# Altium project PROC101D_SCH_With_Design_Updates..Notes_V1.0.PrjPcb (part 11 of 23)

## Sheet 25.SchDoc
size 513 x 386 mm
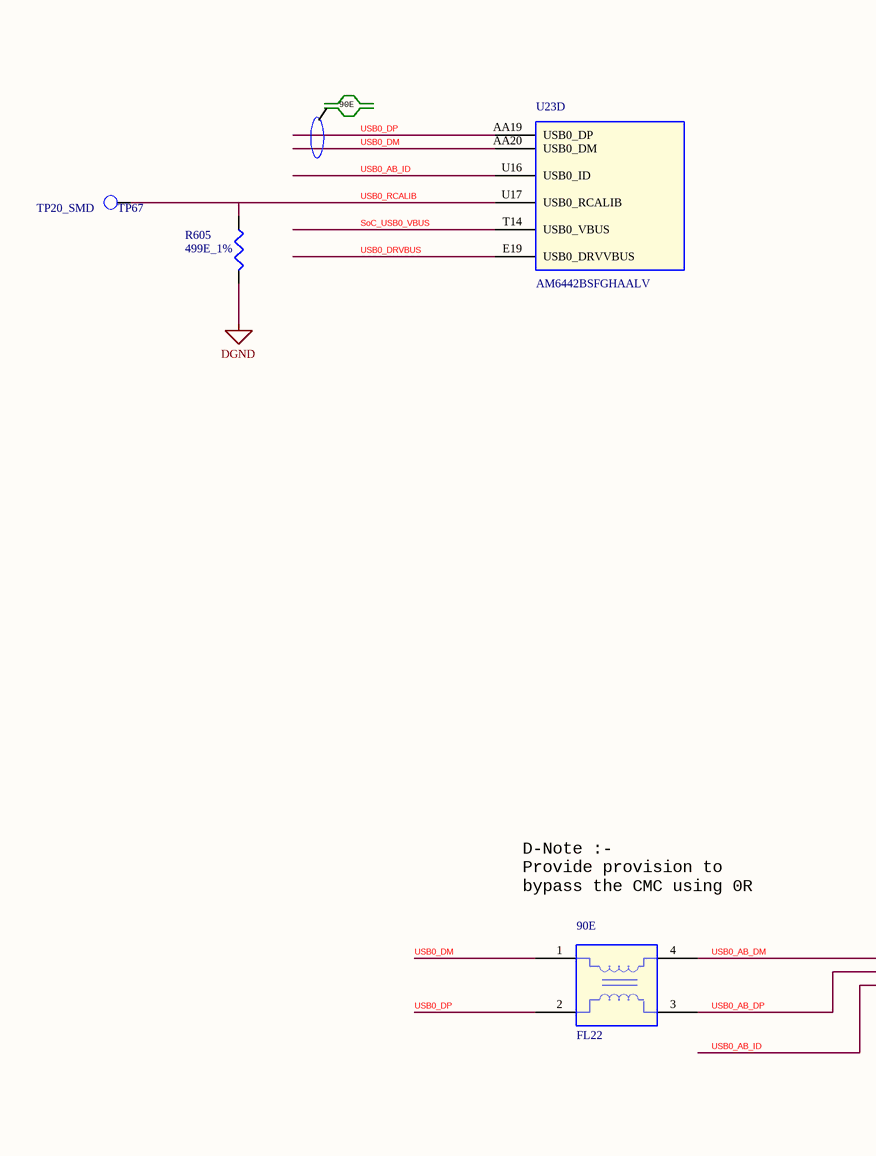
[diagram p42: 25.SchDoc, left]
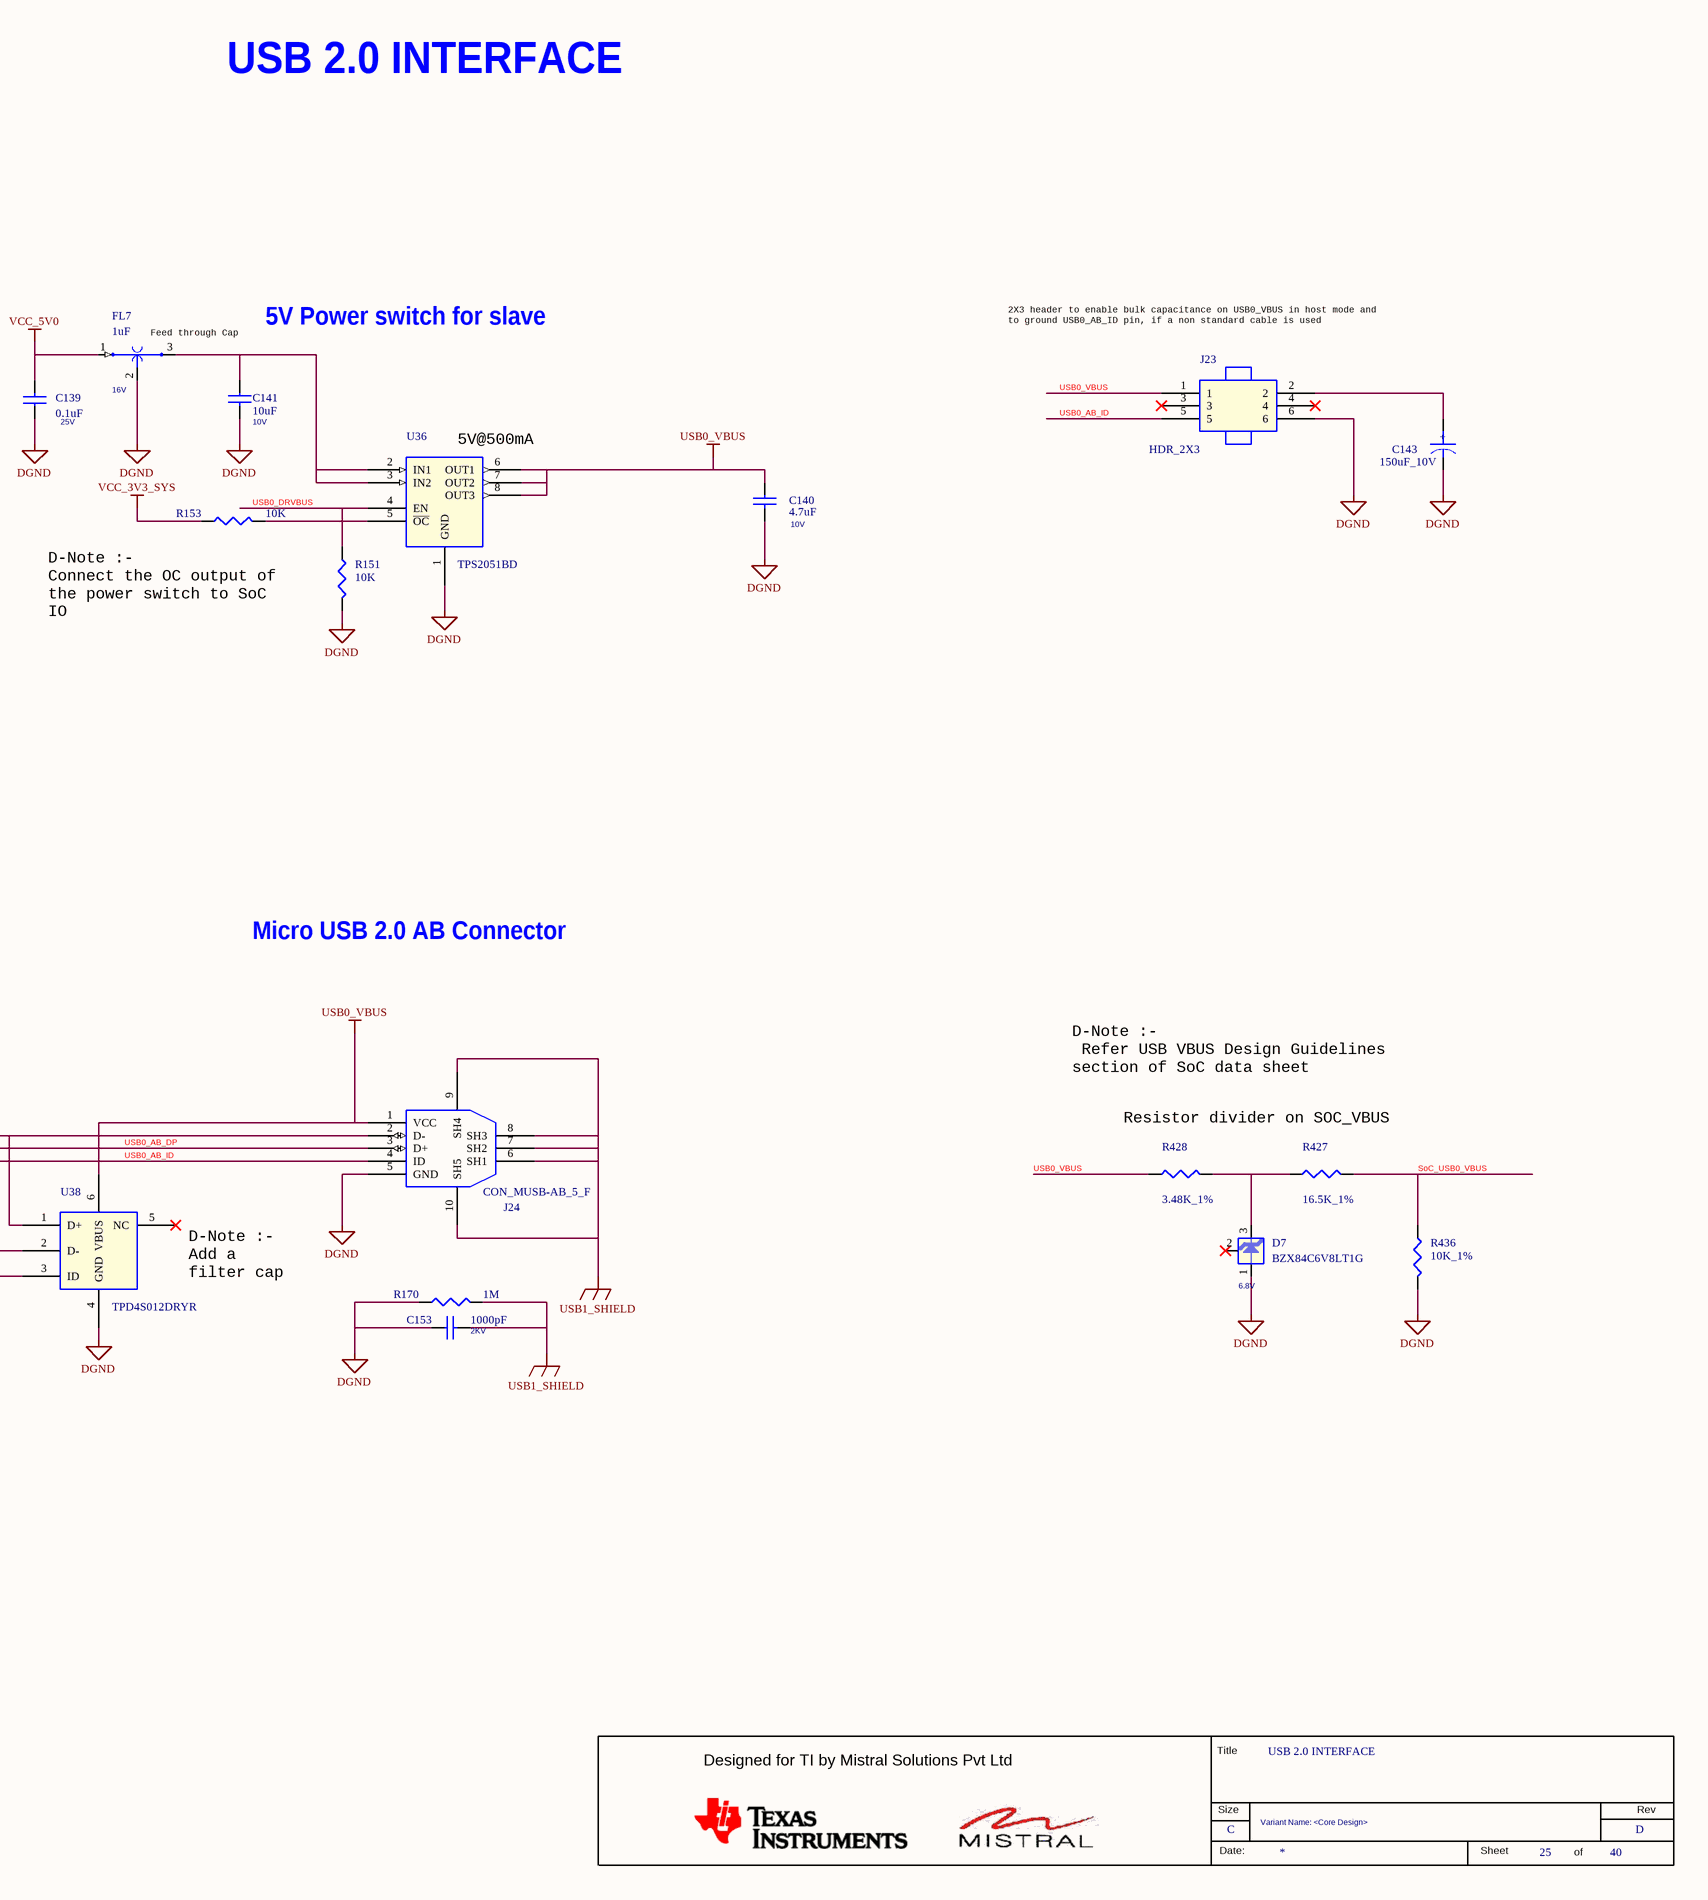
[diagram p43: 25.SchDoc, right]

### Parts
(Parts that share a designator on the sheet are numbered #1, #2 ... from top to bottom, then left to right.)
*#25  RevCode: D  Title: USB 2.0 INTERFACE  Page Size: C  Page Number: 25  Page Count: 40  Variant Name: <Core Design>  (hidden comment: MISTRAL_TITLEBLK_CSIZE)  (graphical)
C139  0.1uF  Voltage: 25V  [CAP0402_0-75]
C140  4.7uF  Voltage: 10V  [CAP0402_0-75]
C141  10uF  Voltage: 10V  [CAP0402_0-75]
C143  150uF_10V  [CAPT7343D_3-25]
C153  1000pF  Voltage: 2KV  [CAP1206_1-75]
D7  BZX84C6V8LT1G  Voltage: 6.8V  [SOT23-123_1-2]
FL7  1uF  Voltage: 16V  [FILT3_NFM21PC_0805_1]
FL22  90E  [IND4_ACM2012_90X50_SMD_1-3]
J23  HDR_2X3  [CON_3X2_SM_2MM]
J24  CON_MUSB-AB_5_F  [CON_USBAB5_ZX62RD-AB-5P8_S_R_S_3-2]
R151  10K  [RES0402_0-5]
R153  10K  [RES0402_0-5]
R170  1M  [RES0603_0-75]
R427  16.5K_1%  [RES0402_0-5]
R428  3.48K_1%  [RES0402_0-5]
R436  10K_1%  [RES0402_0-5]
R605  499E_1%  [RES0402_0-5]
TP67  TP20_SMD  [TP20_SMD]
U23  AM6442BSFGHAALV  [FCBGA441_31-49_680X680_2-6]  (part D of 16)
U36  TPS2051BD  [SOIC8_1-8]
U38  TPD4S012DRYR  [SON6_SN74LVC2G17_40X60_0-6]

### Nets
DGND: C139.1 C140.2 C141.2 C143.2 C153.1 D7.1(A) FL7.2(GND) J23.6 J24.5(GND) R151.2 R170.1 R436.2 R605.2 U36.1(GND) U38.4(GND)
USB0_VBUS: C140.1 J23.1 J24.1(VCC) R428.1 U36.6(OUT1) U36.7(OUT2) U36.8(OUT3) U38.6(VBUS)
USB1_SHIELD: C153.2 J24.6(SH1) J24.7(SH2) J24.8(SH3) J24.9(SH4) J24.10(SH5) R170.2
VCC_3V3_SYS: R153.1
VCC_5V0: C139.2 FL7.1(INPUT)
SoC_USB0_VBUS: R427.2 R436.1 U23.T14(USB0_VBUS)
USB0_AB_DM: FL22.4 J24.2(D-) U38.1(D+)
USB0_AB_DP: FL22.3 J24.3(D+) U38.2(D-)
USB0_AB_ID: J23.5 J24.4(ID) U23.U16(USB0_ID) U38.3(ID)
USB0_DM: FL22.1 U23.AA20(USB0_DM)
USB0_DP: FL22.2 U23.AA19(USB0_DP)
USB0_DRVBUS: R151.1 U23.E19(USB0_DRVVBUS) U36.4(EN)
USB0_RCALIB: R605.1 TP67.1(TP) U23.U17(USB0_RCALIB)
NetC141_1: C141.1 FL7.3(OUTPUT) U36.2(IN1) U36.3(IN2)
NetC143_1: C143.1 J23.2
NetD7_3: D7.3(C) R427.1 R428.2
NetR153_2: R153.2 U36.5(~{OC})

Not connected (* = marked no-connect by the designer): D7 2(NC)*; J23 3* 4*; U38 5(NC)*

### Notes on the sheet
- USB 2.0 INTERFACE
- 2X3 header to enable bulk capacitance on USB0_VBUS in host mode and
  to ground USB0_AB_ID pin, if a non standard cable is used
- 90E
- (near FL7) Feed through Cap
- 5V Power switch for slave
- (near U36) 5V@500mA
- (near R153) D-Note :-
  Connect the OC output of
  the power switch to SoC
  IO
- Micro USB 2.0 AB Connector
- D-Note :-
  Provide provision to
  bypass the CMC using 0R
- D-Note :-
  Refer USB VBUS Design Guidelines
  section of SoC data sheet
- Resistor divider on SOC_VBUS
- D-Note :-
  Add a
  filter cap
- (in symbol CAP_POL_Dup1) +
- (in symbol MISTRAL_TITLEBLK_CSIZE) Title; Designed for TI by Mistral Solutions Pvt Ltd; Size; Rev; Date:; Sheet; of

### Library data of the parts
*#25 = MISTRAL_TITLEBLK_CSIZE: Issue: 1.0; Page Create Date: March  8, 1995; Page Modify Date: *
C139 = CAP_Dup3: as C185 on sheet 22; PCB Footprint: CAP0402_0-75; Tolerance: 20%; Package: 0402; Distributor_name: DIGIKEY; Distributor_part_number: 732-7495-1-ND; Height: 0.55MM; Weight: 0.65mg; Temperature: -55癈+85癈; Datasheet: Y:\MIS_DATABASE\DATASHEETS\CAPACITORS\885012105018.PDF; Crtd /date: ALVY/170820; Chkd/date: MANIRAJA/170820; MECHANICAL 3D STEP FILE: CAP0402_0-75; Library Ref: CAP; Footprint Ref: CAP0402_0-75; Library Path: Y:\MIS_DATABASE\Library\ALTIUM_TOOL\SCHEMATICS_PARTS\MS_DISCRETE_Library.schlib; Footprint Path: Y:\MIS_DATABASE\Library\ALTIUM_TOOL\PCB_FOOTPRINTS\Altium_Footprint_Lib.PcbLib
C140 = CAP_Dup3: CAP CERAMIC 4.7uF 10V 20% X5R 0402; Mistral Part No: 120012060002-R; Mfr_name: AVX CORPORATION; Mfr_part_number: 0402ZD475MAT2A; Part_type: CAPACITORS\CERAMIC; Project: TI_MAXIE_CPB; Wattage: NA; Customs_HS_Code: 85322990; Custom_Duty: 15%; PCB Footprint: CAP0402_0-75; Footprint Path: Y:\MIS_DATABASE\Library\ALTIUM_TOOL\PCB_FOOTPRINTS\Altium_Footprint_Lib.PcbLib; Library Path: Y:\MIS_DATABASE\Library\ALTIUM_TOOL\SCHEMATICS_PARTS\MS_DISCRETE_Library.schlib; Footprint Ref: CAP0402_0-75; Tolerance: 20%; Package: 0402; Distributor_name: DIGIKEY; Distributor_part_number: 478-10791-1-ND; Height: 0.71MM; Weight: 0.65mg; Temperature: -55癈+85癈; Datasheet: Y:\MIS_DATABASE\DATASHEETS\CAPACITORS\AVX_MLC.PDF; Crtd /date: MANIRAJA/230118; Chkd/date: MANIRAJA/230118; MECHANICAL 3D STEP FILE: CAP0402_0-75; Library Ref: CAP
C141 = CAP_Dup3: CAP CERAMIC 10uF 10V 20% X5R 0402; Mistral Part No: 120013110019-R; Mfr_name: MURATA; Mfr_part_number: GRM155R61A106ME11D; Part_type: CAPACITORS\CERAMIC; Project: QCS610_NANOSOM; Customs_HS_Code: 85322990; Custom_Duty: 15%; Wattage: NA; PCB Footprint: CAP0402_0-75; Library Ref: CAP; Tolerance: 20%; Package: 0402; Distributor_name: DIGIKEY; Distributor_part_number: 490-GRM155R61A106ME11DTR-ND; Height: 0.55MM; Datasheet: Y:\MIS_DATABASE\DATASHEETS\CAPACITORS\MURATA-GXX-SER_NOV17.PDF; Crtd /date: ALVY/260520; Chkd/date: MANIRAJA/300520; Weight: 3.1mg; Temperature: -55癈+85癈; MECHANICAL 3D STEP FILE: CAP0402_0-75; Footprint Ref: CAP0402_0-75; Library Path: Y:\MIS_DATABASE\Library\ALTIUM_TOOL\SCHEMATICS_PARTS\MS_DISCRETE_Library.schlib; Footprint Path: Y:\MIS_DATABASE\Library\ALTIUM_TOOL\PCB_FOOTPRINTS\Altium_Footprint_Lib.PcbLib
C143 = CAP_POL_Dup1: CAP TANTALUM 150uF 10V 10% ESR 0.9E D7343; Part_type: CAPACITORS\TANTALUM; Mfr_part_number: TAJD157K010TNJV; Mfr_name: AVX CORPORATION; Mistral Part No: 120018010025-R; Custom_Duty: 15%; Customs_HS_Code: 85322990; Wattage: NA; Project: TI_MAXIE_CPB; Footprint Path: Y:\MIS_DATABASE\Library\ALTIUM_TOOL\PCB_FOOTPRINTS\Altium_Footprint_Lib.PcbLib; Library Path: Y:\MIS_DATABASE\Library\ALTIUM_TOOL\SCHEMATICS_PARTS\MS_DISCRETE_Library.schlib; Footprint Ref: CAPT7343D_3-25; MECHANICAL 3D STEP FILE: CAPT7343D_3-25; Chkd/date: MANIRAJA/240118; Crtd /date: MANIRAJA/240118; Datasheet: Y:\MIS_DATABASE\DATASHEETS\CAPACITORS\AVX-TAJ-SER.PDF; Temperature: -55癈+125癈; Weight: 670mg; Height: 3.10MM; Distributor_part_number: 478-11241-1-ND; Distributor_name: DIGIKEY; Package: D7343; Voltage: 10V; Tolerance: 10%; Library Ref: CAP_POL; PCB Footprint: CAPT7343D_3-25
C153 = CAP_Dup3: CAP CERAMIC 1000pF 2KV 10% X7R 1206; Part_type: CAPACITORS\CERAMIC; Mfr_part_number: 1206GC102KAT1A; Mfr_name: AVX CORPORATION; Mistral Part No: 120015080006-R; Custom_Duty: 15%; Customs_HS_Code: 85322990; Project: ADR1B; Wattage: NA; PCB Footprint: CAP1206_1-75; Chkd/date: SHREESHAIL/291106; Crtd /date: MAZHAR/281106; Datasheet: Y:\MIS_DATABASE\DATASHEETS\CAPACITORS\AVX_HV-MLC.PDF; Temperature: -55癈+125癈; Weight: 16.2mg; Height: 1.52MM; Distributor_part_number: 478-2956-1-ND; Distributor_name: DIGIKEY; Package: 1206; Tolerance: 10%; Library Ref: CAP; Footprint Ref: CAP1206_1-75; Library Path: Y:\MIS_DATABASE\Library\ALTIUM_TOOL\SCHEMATICS_PARTS\MS_DISCRETE_Library.schlib; Footprint Path: Y:\MIS_DATABASE\Library\ALTIUM_TOOL\PCB_FOOTPRINTS\Altium_Footprint_Lib.PcbLib; MECHANICAL 3D STEP FILE: CAP1206_1-75
D7 = DIODE_ZENER_SOT23_13: DIODE ZENER 250mW 6.8V SOT23-123; Mistral Part No: 130017100002-R; Mfr_name: ON SEMICONDUCTOR; Part_type: DIODE\ZENER; Project: TI_MAXIE_CPB; Tolerance: NA; Customs_HS_Code: 85412900; Custom_Duty: 15%; Mfr_part_number: BZX84C6V8LT1G; Wattage: NA; Package: SOT23-123; Distributor_name: DIGIKEY; Distributor_part_number: BZX84C6V8LT1GOSCT-ND; Height: 1.11MM; Weight: 8mg; Temperature: -65癈+150癈; Datasheet: Y:\MIS_DATABASE\DATASHEETS\DISCRETES\DIODES\BZX84XX.PDF; Crtd /date: MANIRAJA/031017; Chkd/date: MANIRAJA/031017; MECHANICAL 3D STEP FILE: SOT23-123_1-2; Library Ref: DIODE_ZENER_SOT23_13; PCB Footprint: SOT23-123_1-2
FL7 = FILTER_NFM: PASSIVE FILTER EMI 1uF 16V 0805; Mistral Part No: 130016030041-R; Mfr_name: MURATA; Mfr_part_number: NFM21PC105B1C3D; Project: RCI_DLS_PS; Tolerance: NA; Customs_HS_Code: 85412900; Custom_Duty: 15%; Footprint Ref: FILT3_NFM21PC_0805_1; Part_type: FILTER; Wattage: NA; Package: 0805; Distributor_name: DIGIKEY; Distributor_part_number: 490-3912-1-ND; Library Ref: FILTER_NFM; PCB Footprint: FILT3_NFM21PC_0805_1; Height: 0.95MM; Weight: 12mg; Temperature: -40癈+85癈; Datasheet: Y:\MIS_DATABASE\DATASHEETS\DISCRETES\INDUCTORS\NFM21PC105B1C3.PDF; Crtd /date: JEBRAN/220316; Chkd/date: VASANTHA/140416; MECHANICAL 3D STEP FILE: FILT3_NFM21PC_0805_1; Library Path: Y:\MIS_DATABASE\Library\ALTIUM_TOOL\SCHEMATICS_PARTS\MS_FILTER_Library.schlib; Footprint Path: Y:\MIS_DATABASE\Library\ALTIUM_TOOL\PCB_FOOTPRINTS\Altium_Footprint_Lib.PcbLib
FL22 = EMIFILTER_ACM: PASSIVE FILTER COMMON MODE 90E 400mA SMD; Mistral Part No: 130009030803-R; Mfr_name: TDK CORPORATION; Mfr_part_number: ACM2012-900-2P-T002; Wattage: NA; Project: SMART VIEW_NVR; Customs_HS_Code: 85437099; Custom_Duty: 24%; MECHANICAL 3D STEP FILE: IND4_ACM2012_90X50_SMD_1-3; Temperature: -40癈+85癈; Weight: 5.5mg; Library Ref: EMIFILTER_ACM; Voltage: NA; Tolerance: NA; Part_type: FILTER; Package: SMD; Distributor_name: DIGIKEY; Distributor_part_number: 445-2207-1-ND; Height: 1.30MM; Datasheet: Y:\MIS_DATABASE\DATASHEETS\ICS\MISC\ACM2012-SER.PDF; Crtd /date: MAZHAR/270907; Chkd/date: MANIRAJA/130218; PCB Footprint: IND4_ACM2012_90X50_SMD_1-3
J23 = HEADER_3X2: CON HDR 2X3 2.54MM PITCH ST TH; Part_type: CONNECTOR\HEADERS; Mfr_part_number: TSW-103-07-T-D; Mfr_name: SAMTEC; Mistral Part No: 150018010019-R; OCT Option: G; MECHANICAL 3D STEP FILE: HDR_2X3_TSW-103-07-D_S_T_8-4; Custom_Duty: 24%; Customs_HS_Code: 85369090; Wattage: NA; Project: TI_MAXIE_CPB; Library Ref: HEADER_3X2; Chkd/date: MANIRAJA/230118; Crtd /date: MANIRAJA/220118; Datasheet: Y:\MIS_DATABASE\DATASHEETS\CONNECTORS\TSW-MK.PDF; Temperature: -55癈+105癈; Weight: NA; Height: 8.38MM; Distributor_part_number: SAM1034-03-ND; Distributor_name: DIGIKEY; Package: THRU-HOLE; Voltage: NA; Tolerance: NA; PCB Footprint: HDR_2X3_TSW-103-07-D_S_T_8-4
J24 = CON_USB_MINI-AB_10: CON MICRO USB-AB TYPE 5POS FEMALE RT SMD; Part_type: CONNECTOR\USB; Mfr_part_number: ZX62RD-AB-5P8(30); Mfr_name: HRS; Mistral Part No: 150010040003-R; Custom_Duty: 24%; Customs_HS_Code: 85369090; Wattage: NA; Project: ESEE; Footprint Path: Y:\MIS_DATABASE\Library\ALTIUM_TOOL\PCB_FOOTPRINTS\Altium_Footprint_Lib.PcbLib; Library Path: Y:\MIS_DATABASE\Library\ALTIUM_TOOL\SCHEMATICS_PARTS\MS_CONNECTOR_Library.schlib; MECHANICAL 3D STEP FILE: CON_USBAB5_ZX62RD-AB-5P8_S_R_S_3-2; Chkd/date: MANIRAJA/150620; Crtd /date: MUDDU/090410; Datasheet: Y:\MIS_DATABASE\DATASHEETS\CONNECTORS\ZX62RD-AB-5P8.PDF; Temperature: -30癈+85癈; Weight: NA; Height: 3.15MM; Library Ref: CON_USB_MINI-AB_10; Distributor_part_number: H125777CT-ND; Distributor_name: DIGIKEY; Package: SMD; Voltage: NA; Tolerance: NA; Footprint Ref: CON_USBAB5_ZX62RD-AB-5P8_S_R_S_3-2; PCB Footprint: CON_USBAB5_ZX62RD-AB-5P8_S_R_S_3-2
R151 R153 = RESISTOR_Dup6: as R199 on sheet 22; Footprint Path: Y:\MIS_DATABASE\Library\ALTIUM_TOOL\PCB_FOOTPRINTS\Altium_Footprint_Lib.PcbLib; Library Path: Y:\MIS_DATABASE\Library\ALTIUM_TOOL\SCHEMATICS_PARTS\MS_DISCRETE_Library.schlib; Footprint Ref: RES0402_0-5; Library Ref: RESISTOR; MECHANICAL 3D STEP FILE: RES0402_0-5; Chkd/date: VASANTHA/061216; Crtd /date: MAZHAR/230805; Datasheet: Y:\MIS_DATABASE\DATASHEETS\RESISTORS\RCXXXXL-SER_MAR18.PDF; Temperature: -55癈+155癈; Weight: 0.65mg; Height: 0.40MM; Distributor_part_number: 311-10KJRCT-ND; Distributor_name: DIGIKEY; Package: 0402; Wattage: 1/16W; Tolerance: 5%; PCB Footprint: RES0402_0-5
R170 = RESISTOR_Dup6: RES 1M 1/10W 5% 0603; Mistral Part No: 110009030413-R; Mfr_name: PANASONIC-ECG; Mfr_part_number: ERJ-3GEYJ105V; Part_type: RESISTORS\FIXED; Project: BSN; Voltage: NA; Customs_HS_Code: 85332119; Custom_Duty: 15%; Footprint Path: Y:\MIS_DATABASE\Library\ALTIUM_TOOL\PCB_FOOTPRINTS\Altium_Footprint_Lib.PcbLib; Library Path: Y:\MIS_DATABASE\Library\ALTIUM_TOOL\SCHEMATICS_PARTS\MS_DISCRETE_Library.schlib; Footprint Ref: RES0603_0-75; Library Ref: RESISTOR; Tolerance: 5%; Wattage: 1/10W; Package: 0603; Distributor_name: DIGIKEY; Distributor_part_number: P1.0MGCT-ND; Height: 0.55MM; Weight: 2mg; Temperature: -55癈+155癈; Datasheet: Y:\MIS_DATABASE\DATASHEETS\RESISTORS\PAN-ERJSER_NOV17.PDF; Crtd /date: USMAN/111207; Chkd/date: VASANTHA/060217; MECHANICAL 3D STEP FILE: RES0603_0-75; PCB Footprint: RES0603_0-75
R427 = RESISTOR_Dup1: RES 16.5K 1/16W 1% 0402; Part_type: RESISTORS\FIXED; Mfr_part_number: RC0402FR-0716K5L; Mfr_name: YAGEO AMERICA; Mistral Part No: 110020120011-R; Custom_Duty: 15%; Customs_HS_Code: 85332119; Voltage: NA; Project: TI_AM243x LP EVM; Footprint Path: Y:\MIS_DATABASE\Library\ALTIUM_TOOL\PCB_FOOTPRINTS\Altium_Footprint_Lib.PcbLib; Library Path: Y:\MIS_DATABASE\Library\ALTIUM_TOOL\SCHEMATICS_PARTS\MS_DISCRETE_Library.schlib; MECHANICAL 3D STEP FILE: RES0402_0-5; Chkd/date: ALVY/091220; Crtd /date: MANIRAJA/091220; Datasheet: Y:\MIS_DATABASE\DATASHEETS\RESISTORS\RCXXXXL-SER_MAR18.PDF; Temperature: -55癈+155癈; Weight: 0.65mg; Height: 0.40MM; Library Ref: RESISTOR; Distributor_part_number: YAG3002CT-ND; Distributor_name: DIGIKEY; Package: 0402; Wattage: 1/16W; Tolerance: 1%; Footprint Ref: RES0402_0-5; PCB Footprint: RES0402_0-5
R428 = RESISTOR_Dup1: RES 3.48K 1/16W 1% 0402; Part_type: RESISTORS\FIXED; Mfr_part_number: RC0402FR-073K48L; Mfr_name: YAGEO AMERICA; Mistral Part No: 110019120035-R; Custom_Duty: 15%; Customs_HS_Code: 85332119; Voltage: NA; Project: TI_AM243x LP EVM; Footprint Path: Y:\MIS_DATABASE\Library\ALTIUM_TOOL\PCB_FOOTPRINTS\Altium_Footprint_Lib.PcbLib; Library Path: Y:\MIS_DATABASE\Library\ALTIUM_TOOL\SCHEMATICS_PARTS\MS_DISCRETE_Library.schlib; MECHANICAL 3D STEP FILE: RES0402_0-5; Chkd/date: ALVY/091220; Crtd /date: MANIRAJA/091220; Datasheet: Y:\MIS_DATABASE\DATASHEETS\RESISTORS\RCXXXXL-SER_MAR18.PDF; Temperature: -55癈+155癈; Weight: 0.65mg; Height: 0.40MM; Library Ref: RESISTOR; Distributor_part_number: YAG3148CT-ND; Distributor_name: DIGIKEY; Package: 0402; Wattage: 1/16W; Tolerance: 1%; Footprint Ref: RES0402_0-5; PCB Footprint: RES0402_0-5
R436 = RESISTOR_Dup6: RES 10K 1/16W 1% 0402; Part_type: RESISTORS\FIXED; Mfr_part_number: RC0402FR-0710KL; Mfr_name: YAGEO AMERICA; Mistral Part No: 110015090015-R; Custom_Duty: 15%; Customs_HS_Code: 85332119; Voltage: NA; Project: VOCERA; Chkd/date: VASANTHA/201216; Crtd /date: GEETHA/290506; Datasheet: Y:\MIS_DATABASE\DATASHEETS\RESISTORS\RCXXXXL-SER_MAR18.PDF; Temperature: -55癈+155癈; Weight: 0.65mg; Height: 0.40MM; Distributor_part_number: 311-10.0KLRTR-ND; Distributor_name: DIGIKEY; Package: 0402; Wattage: 1/16W; Tolerance: 1%; MECHANICAL 3D STEP FILE: RES0402_0-5; Library Ref: RESISTOR; Footprint Ref: RES0402_0-5; Library Path: Y:\MIS_DATABASE\Library\ALTIUM_TOOL\SCHEMATICS_PARTS\MS_DISCRETE_Library.schlib; Footprint Path: Y:\MIS_DATABASE\Library\ALTIUM_TOOL\PCB_FOOTPRINTS\Altium_Footprint_Lib.PcbLib; PCB Footprint: RES0402_0-5
R605 = RESISTOR_Dup6: RES 499E 1/16W 1% 0402; Part_type: RESISTORS\FIXED; Mfr_part_number: RC0402FR-07499RL; Mfr_name: YAGEO AMERICA; Mistral Part No: 110020080006-R; Custom_Duty: 15%; Customs_HS_Code: 85332119; Voltage: NA; Project: AM64XX_EVM; PCB Footprint: RES0402_0-5; Footprint Path: Y:\MIS_DATABASE\Library\ALTIUM_TOOL\PCB_FOOTPRINTS\Altium_Footprint_Lib.PcbLib; Library Path: Y:\MIS_DATABASE\Library\ALTIUM_TOOL\SCHEMATICS_PARTS\MS_DISCRETE_Library.schlib; MECHANICAL 3D STEP FILE: RES0402_0-5; Chkd/date: MANIRAJA/051020; Crtd /date: ALVY/051020; Datasheet: Y:\MIS_DATABASE\DATASHEETS\RESISTORS\RCXXXXL-SER_MAR18.PDF; Temperature: -55癈+155癈; Weight: 0.65mg; Height: 0.40MM; Footprint Ref: RES0402_0-5; Library Ref: RESISTOR; Distributor_part_number: 311-499LRCT-ND; Distributor_name: DIGIKEY; Package: 0402; Wattage: 1/16W; Tolerance: 1%
TP67 = TESTPOINT: as TP35 on sheet 22; PCB Footprint: TP20_SMD; RoHS: NA; Footprint Ref: TP20_SMD; Library Ref: TESTPOINT; Footprint Path: Y:\MIS_DATABASE\Library\ALTIUM_TOOL\PCB_FOOTPRINTS\Altium_Footprint_Lib.PcbLib; Library Path: Y:\MIS_DATABASE\Library\ALTIUM_TOOL\SCHEMATICS_PARTS\MS_DISCRETE_Library.schlib; Datasheet: NA; Temperature: NA; Weight: NA; Wattage: NA; Voltage: NA; Tolerance: NA; Chkd/date: SHREESHAIL/171006; Crtd /date: MAZHAR/171006; Height: NA; Distributor_part_number: NA; Distributor_name: NA; Package: SMD; Part_type: TESTPOINT; Mfr_part_number: TP20_SMD; Mistral Part No: NA; Customs_HS_Code: NA; Custom_Duty: NA
U23 = XAM6442BSFGGAALV_BGA441: IC AM64x SoC MICROPROCESSOR BGA441; Part_type: ICS\DIGITAL\MICROPROCESSOR; Mfr_name: TEXAS INSTRUMENTS; Mistral Part No: 141220080002; Custom_Duty: 15%; Customs_HS_Code: 85423100; Wattage: NA; Project: AM64x-GP_EVM BRD; Footprint Path: Y:\MIS_DATABASE\Library\ALTIUM_TOOL\PCB_FOOTPRINTS\Altium_Footprint_Lib.PcbLib; Library Path: Y:\MIS_DATABASE\Library\ALTIUM_TOOL\SCHEMATICS_PARTS\MS_MICROPROCESSOR_Library.schlib; MECHANICAL 3D STEP FILE: FCBGA441_31-49_680X680_2-6; RoHS: NA; Chkd/date: ALVY/300322; Crtd /date: ALVY/300322; Datasheet: Y:\MIS_DATABASE\DATASHEETS\ICS\DIGITAL\MICROCONTROLLER\AM64-SoC_SVB.PDF; Temperature: NA; Weight: NA; Height: 2.57MM; Library Ref: XAM6442BSFGGAALV_BGA441; Distributor_part_number: NA; Distributor_name: NA; Package: BGA441; Voltage: NA; Tolerance: NA; Mfr_part_number: AM6442BSFGHAALV; Footprint Ref: FCBGA441_31-49_680X680_2-6; PCB Footprint: FCBGA441_31-49_680X680_2-6
U36 = TPS2051BD_SOIC8: IC POWER DISTRIBUTION SWITCH SOIC8; Part_type: ICS\POWER; Mfr_name: TEXAS INSTRUMENTS; Mistral Part No: 142014060011-R; Custom_Duty: 15%; Customs_HS_Code: 85423100; Wattage: NA; Project: AEGIS_POM; Chkd/date: NAVEED/150714; Crtd /date: VASANTHA/190614; Datasheet: Y:\MIS_DATABASE\DATASHEETS\MISC\REGULATORS\TPS2051BDBVR.PDF; Temperature: -40癈+125癈; Weight: 72.6mg; Height: 1.75MM; Distributor_part_number: 296-26911-5-ND; Distributor_name: DIGIKEY; Package: SOIC8; Voltage: NA; Tolerance: NA; Mfr_part_number: TPS2051BD; Library Ref: TPS2051BD_SOIC8; Footprint Ref: SOIC8_1-8; MECHANICAL 3D STEP FILE: SOIC8_1-8; Library Path: Y:\MIS_DATABASE\Library\ALTIUM_TOOL\SCHEMATICS_PARTS\MS_MISCPOWER_Library.schlib; Footprint Path: Y:\MIS_DATABASE\Library\ALTIUM_TOOL\PCB_FOOTPRINTS\Altium_Footprint_Lib.PcbLib; PCB Footprint: SOIC8_1-8
U38 = TPD4S012DRY_SON6: IC 4CH ESD SOLUTION FOR USB-HS/USB OTG/USB CHARGER INTERFACE SON6; Mistral Part No: 141011080022-R; Mfr_name: TEXAS INSTRUMENTS; Part_type: ICS\INTERFACE; Project: ACRO_DM3730; Tolerance: NA; Customs_HS_Code: 85423100; Custom_Duty: 15%; Footprint Path: Y:\MIS_DATABASE\Library\ALTIUM_TOOL\PCB_FOOTPRINTS\Altium_Footprint_Lib.PcbLib; Library Path: Y:\MIS_DATABASE\Library\ALTIUM_TOOL\SCHEMATICS_PARTS\MS_MISCINTERFACE_Library.schlib; Footprint Ref: SON6_SN74LVC2G17_40X60_0-6; Library Ref: TPD4S012DRY_SON6; Mfr_part_number: TPD4S012DRYR; Voltage: NA; Wattage: NA; Package: SON6; Distributor_name: DIGIKEY; Distributor_part_number: 296-24244-1-ND; Height: 0.60MM; Weight: 3.2mg; Temperature: -40癈+85癈; Datasheet: Y:\MIS_DATABASE\DATASHEETS\ICS\INTERFACE\TPD4S012DRYR.PDF; Crtd /date: BAVISH/190811; Chkd/date: MANIRAJA/040719; MECHANICAL 3D STEP FILE: SON6_SN74LVC2G17_40X60_0-6; PCB Footprint: SON6_SN74LVC2G17_40X60_0-6

## Sheet 26.SchDoc
size 513 x 386 mm
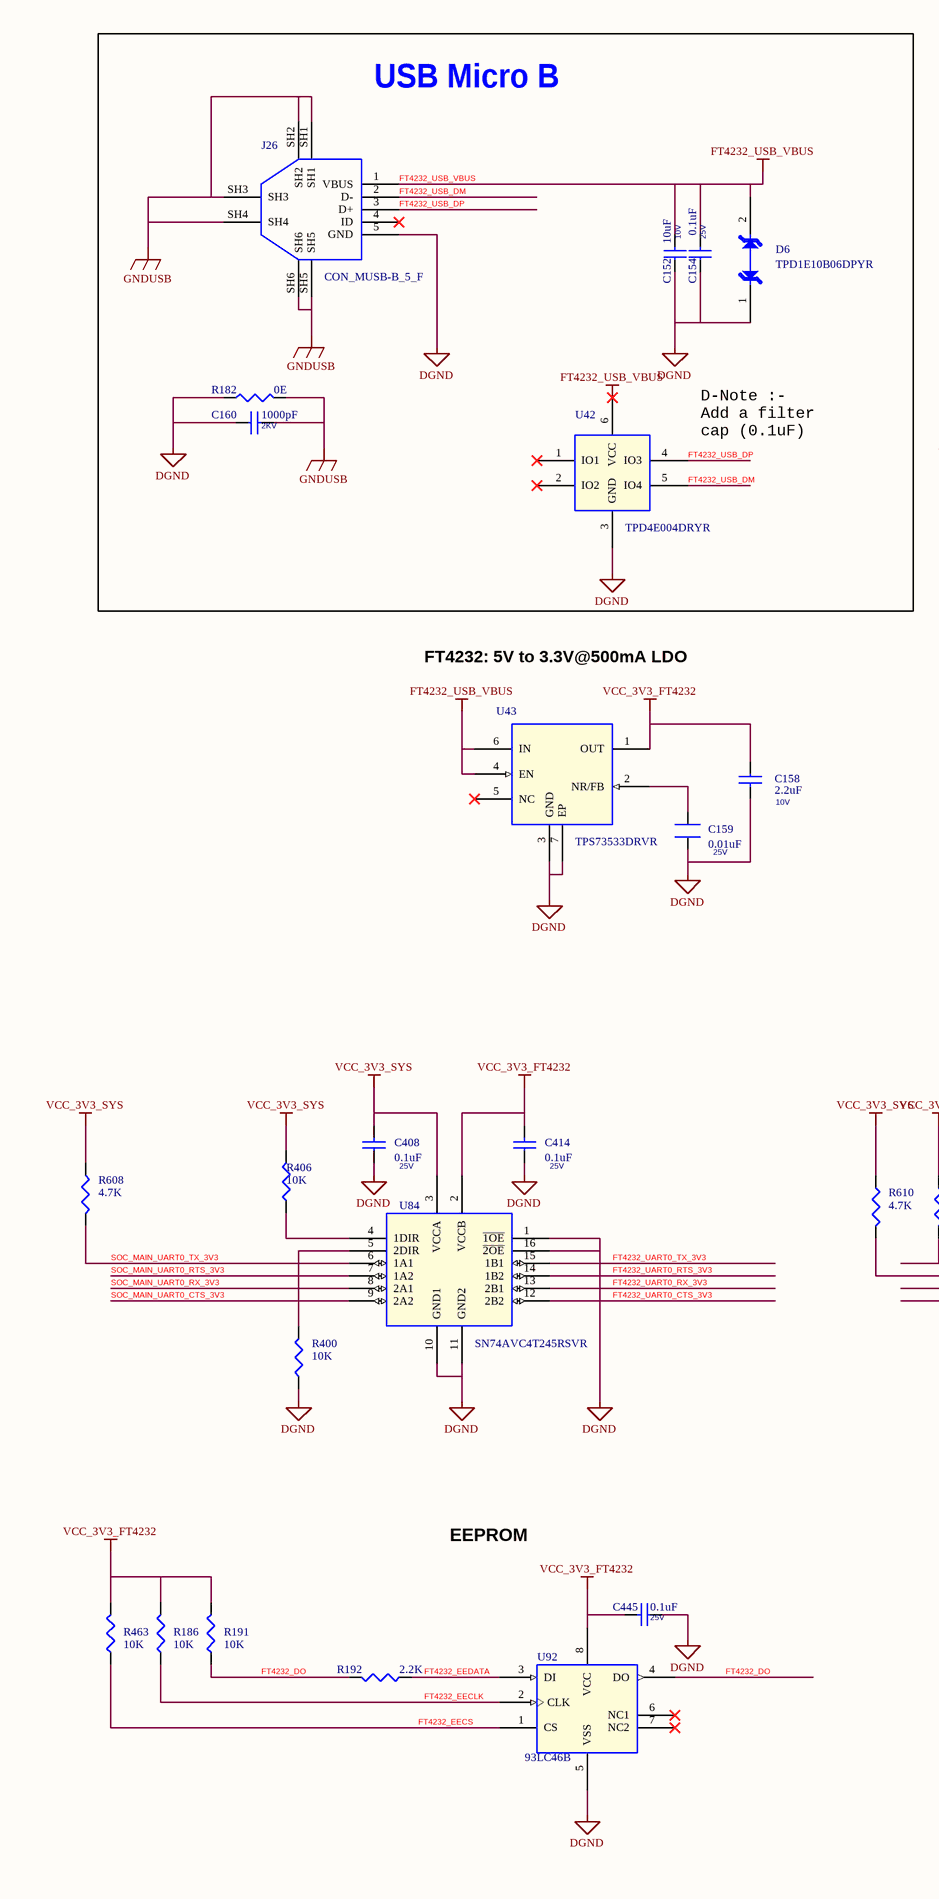
[diagram p44: 26.SchDoc, left]
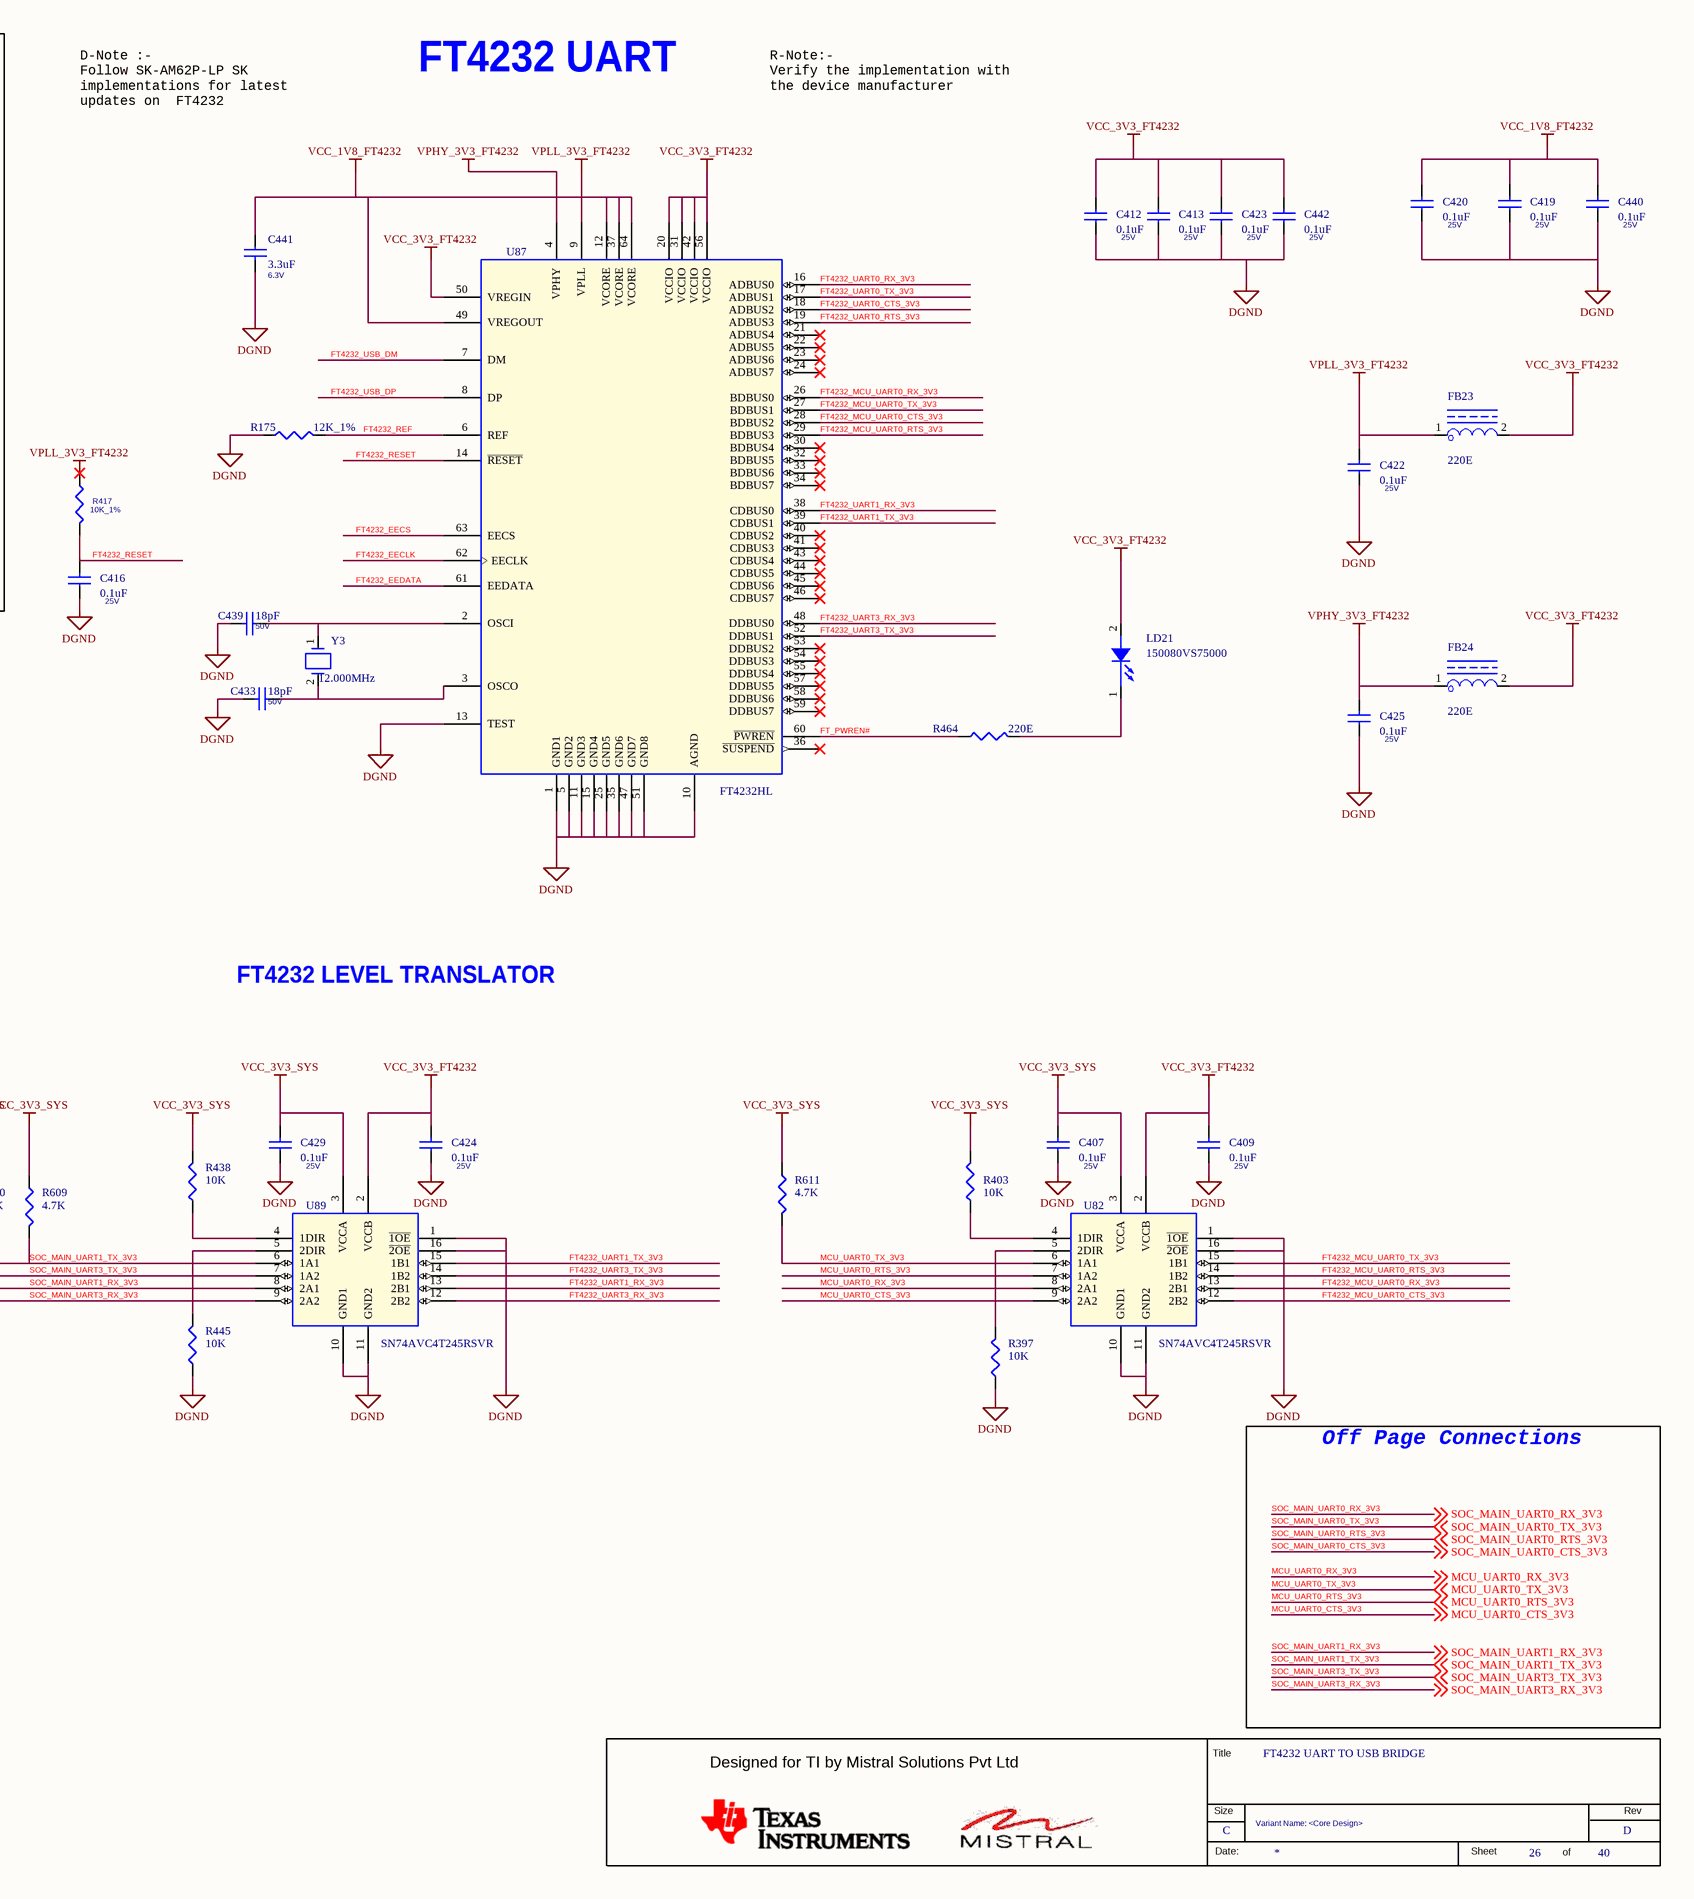
[diagram p45: 26.SchDoc, right]

### Parts
(Parts that share a designator on the sheet are numbered #1, #2 ... from top to bottom, then left to right.)
*#26  RevCode: D  Title: FT4232 UART TO USB BRIDGE  Page Size: C  Page Number: 26  Page Count: 40  Variant Name: <Core Design>  (hidden comment: MISTRAL_TITLEBLK_CSIZE)  (graphical)
C152  10uF  Voltage: 10V  [CAP0402_0-75]
C154  0.1uF  Voltage: 25V  [CAP0402_0-75]
C158  2.2uF  Voltage: 10V  [CAP0402_0-75]
C159  0.01uF  Voltage: 25V  [CAP0402N]
C160  1000pF  Voltage: 2KV  [CAP1206_1-75]
C407  0.1uF  Voltage: 25V  [CAP0402_0-75]
C408  0.1uF  Voltage: 25V  [CAP0402_0-75]
C409  0.1uF  Voltage: 25V  [CAP0402_0-75]
C412  0.1uF  Voltage: 25V  [CAP0402_0-75]
C413  0.1uF  Voltage: 25V  [CAP0402_0-75]
C414  0.1uF  Voltage: 25V  [CAP0402_0-75]
C416  0.1uF  Voltage: 25V  [CAP0402_0-75]
C419  0.1uF  Voltage: 25V  [CAP0402_0-75]
C420  0.1uF  Voltage: 25V  [CAP0402_0-75]
C422  0.1uF  Voltage: 25V  [CAP0402_0-75]
C423  0.1uF  Voltage: 25V  [CAP0402_0-75]
C424  0.1uF  Voltage: 25V  [CAP0402_0-75]
C425  0.1uF  Voltage: 25V  [CAP0402_0-75]
C429  0.1uF  Voltage: 25V  [CAP0402_0-75]
C433  18pF  Voltage: 50V  [CAP0402_0-75]
C439  18pF  Voltage: 50V  [CAP0402_0-75]
C440  0.1uF  Voltage: 25V  [CAP0402_0-75]
C441  3.3uF  Voltage: 6.3V  [CAP0603_1]
C442  0.1uF  Voltage: 25V  [CAP0402_0-75]
C445  0.1uF  Voltage: 25V  [CAP0402_0-75]
D6  TPD1E10B06DPYR  [DIO_DFN0402_0-5]
FB23  220E  [IND0402_0-6]
FB24  220E  [IND0402_0-6]
J26  CON_MUSB-B_5_F  [CON_MUSBB5_1051640001_S_R_S_2-5]
LD21  150080VS75000  [LED_150080VS75000_80X50_SMD_0-8]
R175  12K_1%  [RES0402_0-5]
R182  0E  [RES1206_0-75]
R186  10K  [RES0402_0-5]
R191  10K  [RES0402_0-5]
R192  2.2K  [RES0402_0-5]
R397  10K  [RES0402_0-5]
R400  10K  [RES0402_0-5]
R403  10K  [RES0402_0-5]
R406  10K  [RES0402_0-5]
R417  10K_1%  [RES0402N]
R438  10K  [RES0402_0-5]
R445  10K  [RES0402_0-5]
R463  10K  [RES0402_0-5]
R464  220E  [RES0402_0-5]
R608  4.7K  [RES0402_0-5]
R609  4.7K  [RES0402_0-5]
R610  4.7K  [RES0402_0-5]
R611  4.7K  [RES0402_0-5]
U42  TPD4E004DRYR  [SON6_19-68_40X60_PB_0-6]
U43  TPS73533DRVR  [SON6_25-59_85X85]
U82  SN74AVC4T245RSVR  [UQFN16_TMUX1574_70X100_0-6]
U84  SN74AVC4T245RSVR  [UQFN16_TMUX1574_70X100_0-6]
U87  FT4232HL  [LQF64]
U89  SN74AVC4T245RSVR  [UQFN16_TMUX1574_70X100_0-6]
U92  93LC46B  [MSOP8_25-59_125X125_1-1]
Y3  12.000MHz  [XTAL_ABM3_205X130_SMD_1-4]

### Blocks framed on the sheet
USB Micro B: C152 C154 C160 D6 J26 R182 U42

### Nets
DGND: C152.1 C154.1 C158.2 C159.1 C160.1 C407.1 C408.1 C409.1 C412.1 C413.1 C414.1 C416.1 C419.1 C420.1 C422.1 C423.1 C424.1 C425.1 C429.1 C433.2 C439.2 C440.1 C441.2 C442.1 C445.1 D6.1 J26.5(GND) R175.1 R182.1 R397.1 R400.1 R445.1 U42.3(GND) U43.3(GND) U43.7(EP) U82.1(~{1OE}) U82.10(GND1) U82.11(GND2) U82.16(~{2OE}) U84.1(~{1OE}) U84.10(GND1) U84.11(GND2) U84.16(~{2OE}) U87.1(GND1) U87.5(GND2) U87.10(AGND) U87.11(GND3) U87.13(TEST) U87.15(GND4) U87.25(GND5) U87.35(GND6) U87.47(GND7) U87.51(GND8) U89.1(~{1OE}) U89.10(GND1) U89.11(GND2) U89.16(~{2OE}) U92.5(VSS)
FT4232_USB_VBUS: C152.2 C154.2 D6.2 J26.1(VBUS) U42.6(VCC) U43.4(EN) U43.6(IN)
GNDUSB: C160.2 J26.SH1 J26.SH2 J26.SH3 J26.SH4 J26.SH5 J26.SH6 R182.2
VCC_1V8_FT4232: C419.2 C420.2 C440.2 C441.1 U87.12(VCORE) U87.37(VCORE) U87.49(VREGOUT) U87.64(VCORE)
VCC_3V3_FT4232: C158.1 C409.2 C412.2 C413.2 C414.2 C423.2 C424.2 C442.2 C445.2 FB23.2 FB24.2 LD21.2(ANODE) R186.2 R191.2 R463.2 U43.1(OUT) U82.2(VCCB) U84.2(VCCB) U87.20(VCCIO) U87.31(VCCIO) U87.42(VCCIO) U87.50(VREGIN) U87.56(VCCIO) U89.2(VCCB) U92.8(VCC)
VCC_3V3_SYS: C407.2 C408.2 C429.2 R403.2 R406.2 R438.2 R608.1 R609.1 R610.1 R611.1 U82.3(VCCA) U84.3(VCCA) U89.3(VCCA)
VPHY_3V3_FT4232: C425.2 FB24.1 U87.4(VPHY)
VPLL_3V3_FT4232: C422.2 FB23.1 R417.2 U87.9(VPLL)
FT4232_DO: R191.1 R192.2 U92.4(DO)
FT4232_EECLK: R186.1 U87.62(EECLK) U92.2(CLK)
FT4232_EECS: R463.1 U87.63(EECS) U92.1(CS)
FT4232_EEDATA: R192.1 U87.61(EEDATA) U92.3(DI)
FT4232_MCU_UART0_CTS_3V3: U82.12(2B2) U87.28(BDBUS2)
FT4232_MCU_UART0_RTS_3V3: U82.14(1B2) U87.29(BDBUS3)
FT4232_MCU_UART0_RX_3V3: U82.13(2B1) U87.26(BDBUS0)
FT4232_MCU_UART0_TX_3V3: U82.15(1B1) U87.27(BDBUS1)
FT4232_REF: R175.2 U87.6(REF)
FT4232_RESET: C416.2 R417.1 U87.14(~{RESET})
FT4232_UART0_CTS_3V3: U84.12(2B2) U87.18(ADBUS2)
FT4232_UART0_RTS_3V3: U84.14(1B2) U87.19(ADBUS3)
FT4232_UART0_RX_3V3: U84.13(2B1) U87.16(ADBUS0)
FT4232_UART0_TX_3V3: U84.15(1B1) U87.17(ADBUS1)
FT4232_UART1_RX_3V3: U87.38(CDBUS0) U89.13(2B1)
FT4232_UART1_TX_3V3: U87.39(CDBUS1) U89.15(1B1)
FT4232_UART3_RX_3V3: U87.48(DDBUS0) U89.12(2B2)
FT4232_UART3_TX_3V3: U87.52(DDBUS1) U89.14(1B2)
FT4232_USB_DM: J26.2(D-) U42.5(IO4) U87.7(DM)
FT4232_USB_DP: J26.3(D+) U42.4(IO3) U87.8(DP)
FT_PWREN#: R464.1 U87.60(~{PWREN})
MCU_UART0_CTS_3V3: U82.9(2A2) ; off-sheet MCU_UART0_CTS_3V3
MCU_UART0_RTS_3V3: U82.7(1A2) ; off-sheet MCU_UART0_RTS_3V3
MCU_UART0_RX_3V3: U82.8(2A1) ; off-sheet MCU_UART0_RX_3V3
MCU_UART0_TX_3V3: R611.2 U82.6(1A1) ; off-sheet MCU_UART0_TX_3V3
SOC_MAIN_UART0_CTS_3V3: U84.9(2A2) ; off-sheet SOC_MAIN_UART0_CTS_3V3
SOC_MAIN_UART0_RTS_3V3: U84.7(1A2) ; off-sheet SOC_MAIN_UART0_RTS_3V3
SOC_MAIN_UART0_RX_3V3: U84.8(2A1) ; off-sheet SOC_MAIN_UART0_RX_3V3
SOC_MAIN_UART0_TX_3V3: R608.2 U84.6(1A1) ; off-sheet SOC_MAIN_UART0_TX_3V3
SOC_MAIN_UART1_RX_3V3: U89.8(2A1) ; off-sheet SOC_MAIN_UART1_RX_3V3
SOC_MAIN_UART1_TX_3V3: R609.2 U89.6(1A1) ; off-sheet SOC_MAIN_UART1_TX_3V3
SOC_MAIN_UART3_RX_3V3: U89.9(2A2) ; off-sheet SOC_MAIN_UART3_RX_3V3
SOC_MAIN_UART3_TX_3V3: R610.2 U89.7(1A2) ; off-sheet SOC_MAIN_UART3_TX_3V3
NetC159_2: C159.2 U43.2(NR/FB)
NetC433_1: C433.1 U87.3(OSCO) Y3.2
NetC439_1: C439.1 U87.2(OSCI) Y3.1
NetLD21_1: LD21.1(CATHODE) R464.2
NetR397_2: R397.2 U82.5(2DIR)
NetR400_2: R400.2 U84.5(2DIR)
NetR403_1: R403.1 U82.4(1DIR)
NetR406_1: R406.1 U84.4(1DIR)
NetR438_1: R438.1 U89.4(1DIR)
NetR445_2: R445.2 U89.5(2DIR)

Not connected (* = marked no-connect by the designer): J26 4(ID)*; U42 1(IO1)* 2(IO2)*; U43 5(NC)*; U87 21(ADBUS4)* 22(ADBUS5)* 23(ADBUS6)* 24(ADBUS7)* 30(BDBUS4)* 32(BDBUS5)* 33(BDBUS6)* 34(BDBUS7)* 36(~{SUSPEND})* 40(CDBUS2)* 41(CDBUS3)* 43(CDBUS4)* 44(CDBUS5)* 45(CDBUS6)* 46(CDBUS7)* 53(DDBUS2)* 54(DDBUS3)* 55(DDBUS4)* 57(DDBUS5)* 58(DDBUS6)* 59(DDBUS7)*; U92 6(NC1)* 7(NC2)*

### Notes on the sheet
- D-Note :-
  Follow SK-AM62P-LP SK
  implementations for latest
  updates on  FT4232
- FT4232 UART
- R-Note:-
  Verify the implementation with
  the device manufacturer
- D-Note :-
  Add a filter
  cap (0.1uF)
- FT4232: 5V to 3.3V@500mA LDO
- FT4232 LEVEL TRANSLATOR
- Off Page Connections
- EEPROM
- (in symbol MISTRAL_TITLEBLK_CSIZE) Title; Designed for TI by Mistral Solutions Pvt Ltd; Size; Rev; Date:; Sheet; of

### Library data of the parts
*#26 = MISTRAL_TITLEBLK_CSIZE: Issue: 1.0; Page Create Date: March  8, 1995; Page Modify Date: *
C152 = CAP_Dup3: CAP CERAMIC 10uF 10V 20% X5R 0402; Part_type: CAPACITORS\CERAMIC; Mfr_part_number: GRM155R61A106ME11D; Mfr_name: MURATA; Mistral Part No: 120013110019-R; Custom_Duty: 15%; Customs_HS_Code: 85322990; Project: QCS610_NANOSOM; Wattage: NA; Footprint Path: Y:\MIS_DATABASE\Library\ALTIUM_TOOL\PCB_FOOTPRINTS\Altium_Footprint_Lib.PcbLib; Library Path: Y:\MIS_DATABASE\Library\ALTIUM_TOOL\SCHEMATICS_PARTS\MS_DISCRETE_Library.schlib; Footprint Ref: CAP0402_0-75; Chkd/date: MANIRAJA/300520; Crtd /date: ALVY/260520; Datasheet: Y:\MIS_DATABASE\DATASHEETS\CAPACITORS\MURATA-GXX-SER_NOV17.PDF; Height: 0.55MM; Distributor_part_number: 490-GRM155R61A106ME11DTR-ND; Distributor_name: DIGIKEY; Package: 0402; Tolerance: 20%; Weight: 3.1mg; Temperature: -55癈+85癈; MECHANICAL 3D STEP FILE: CAP0402_0-75; Library Ref: CAP; PCB Footprint: CAP0402_0-75
C154 C408 C412-C414 C416 C442 C445 = CAP_Dup3: as C192 on sheet 22; Footprint Path: Y:\MIS_DATABASE\Library\ALTIUM_TOOL\PCB_FOOTPRINTS\Altium_Footprint_Lib.PcbLib; Library Path: Y:\MIS_DATABASE\Library\ALTIUM_TOOL\SCHEMATICS_PARTS\MS_DISCRETE_Library.schlib; Footprint Ref: CAP0402_0-75; Library Ref: CAP; MECHANICAL 3D STEP FILE: CAP0402_0-75; Chkd/date: MANIRAJA/170820; Crtd /date: ALVY/170820; Datasheet: Y:\MIS_DATABASE\DATASHEETS\CAPACITORS\885012105018.PDF; Temperature: -55癈+85癈; Weight: 0.65mg; Height: 0.55MM; Distributor_part_number: 732-7495-1-ND; Distributor_name: DIGIKEY; Package: 0402; Tolerance: 20%; PCB Footprint: CAP0402_0-75
C158 = CAP_Dup3: as C187 on sheet 22; MECHANICAL 3D STEP FILE: CAP0402_0-75; Chkd/date: MANIRAJA/170820; Crtd /date: ALVY/170820; Datasheet: Y:\MIS_DATABASE\DATASHEETS\CAPACITORS\885012105013.PDF; Temperature: -55癈+85癈; Weight: 0.65mg; Height: 0.55MM; Distributor_part_number: 732-7490-1-ND; Distributor_name: DIGIKEY; Package: 0402; Tolerance: 20%; Library Ref: CAP; Footprint Ref: CAP0402_0-75; Library Path: Y:\MIS_DATABASE\Library\ALTIUM_TOOL\SCHEMATICS_PARTS\MS_DISCRETE_Library.schlib; Footprint Path: Y:\MIS_DATABASE\Library\ALTIUM_TOOL\PCB_FOOTPRINTS\Altium_Footprint_Lib.PcbLib; PCB Footprint: CAP0402_0-75
C159 = CAP_Dup2: CAP CERAMIC 0.01uF 25V 10% X7R 0402; Mistral Part No: 120011090040-R; Mfr_name: WURTH ELECTRONICS; Mfr_part_number: 885012205050; Part_type: CAPACITORS\CERAMIC; Project: AM64x_EVM_BRD; Customs_HS_Code: 85322990; Custom_Duty: 15%; Wattage: NA; MECHANICAL 3D STEP FILE: CAP0402_0-75; Library Ref: CAP; Tolerance: 10%; Package: 0402; Distributor_name: DIGIKEY; Distributor_part_number: 732-7545-1-ND; Height: 0.55MM; Datasheet: Y:\MIS_DATABASE\DATASHEETS\CAPACITORS\885012205050.PDF; Crtd /date: ALVY/170820; Chkd/date: MANIRAJA/170820; Weight: 0.65mg; Temperature: -55癈+125癈; Footprint Ref: CAP0402_0-75; Library Path: Y:\MIS_DATABASE\Library\ALTIUM_TOOL\SCHEMATICS_PARTS\MS_DISCRETE_Library.schlib; Footprint Path: Y:\MIS_DATABASE\Library\ALTIUM_TOOL\PCB_FOOTPRINTS\Altium_Footprint_Lib.PcbLib; PCB Footprint: CAP0402_0-75
C160 = CAP_Dup3: CAP CERAMIC 1000pF 2KV 10% X7R 1206; Part_type: CAPACITORS\CERAMIC; Mfr_part_number: 1206GC102KAT1A; Mfr_name: AVX CORPORATION; Mistral Part No: 120015080006-R; Wattage: NA; Custom_Duty: 15%; Customs_HS_Code: 85322990; Project: ADR1B; MECHANICAL 3D STEP FILE: CAP1206_1-75; Temperature: -55癈+125癈; Weight: 16.2mg; Chkd/date: SHREESHAIL/291106; Crtd /date: MAZHAR/281106; Datasheet: Y:\MIS_DATABASE\DATASHEETS\CAPACITORS\AVX_HV-MLC.PDF; Height: 1.52MM; Distributor_part_number: 478-2956-1-ND; Distributor_name: DIGIKEY; Package: 1206; Tolerance: 10%; Library Ref: CAP; Footprint Ref: CAP1206_1-75; Library Path: Y:\MIS_DATABASE\Library\ALTIUM_TOOL\SCHEMATICS_PARTS\MS_DISCRETE_Library.schlib; Footprint Path: Y:\MIS_DATABASE\Library\ALTIUM_TOOL\PCB_FOOTPRINTS\Altium_Footprint_Lib.PcbLib; PCB Footprint: CAP1206_1-75
C407 C409 C419 C420 C422-C425 C429 C440 = CAP_Dup3: as C185 on sheet 22; Tolerance: 20%; Package: 0402; Distributor_name: DIGIKEY; Distributor_part_number: 732-7495-1-ND; Height: 0.55MM; Weight: 0.65mg; Temperature: -55癈+85癈; Datasheet: Y:\MIS_DATABASE\DATASHEETS\CAPACITORS\885012105018.PDF; Crtd /date: ALVY/170820; Chkd/date: MANIRAJA/170820; MECHANICAL 3D STEP FILE: CAP0402_0-75; Library Ref: CAP; Footprint Ref: CAP0402_0-75; Library Path: Y:\MIS_DATABASE\Library\ALTIUM_TOOL\SCHEMATICS_PARTS\MS_DISCRETE_Library.schlib; Footprint Path: Y:\MIS_DATABASE\Library\ALTIUM_TOOL\PCB_FOOTPRINTS\Altium_Footprint_Lib.PcbLib; PCB Footprint: CAP0402_0-75
C433 = CAP_Dup3: CAP CERAMIC 18pF 50V 5% C0G(NP0) 0402; Part_type: CAPACITORS\CERAMIC; Mfr_part_number: C0402C180J5GAC7867; Mfr_name: KEMET; Mistral Part No: 120011090034-R; Wattage: NA; Custom_Duty: 15%; Customs_HS_Code: 85322990; Project: TI_MAXIE_CPB; Temperature: -55癈+125癈; Weight: 0.65mg; Chkd/date: MANIRAJA/070220; Crtd /date: ALVY/070220; Datasheet: Y:\MIS_DATABASE\DATASHEETS\CAPACITORS\KEMET-C0G_SERIES.PDF; Height: 0.55MM; Distributor_part_number: 399-8952-1-ND; Distributor_name: DIGIKEY; Package: 0402; Tolerance: 5%; Library Ref: CAP; Footprint Ref: CAP0402_0-75; MECHANICAL 3D STEP FILE: CAP0402_0-75; Library Path: Y:\MIS_DATABASE\Library\ALTIUM_TOOL\SCHEMATICS_PARTS\MS_DISCRETE_Library.schlib; Footprint Path: Y:\MIS_DATABASE\Library\ALTIUM_TOOL\PCB_FOOTPRINTS\Altium_Footprint_Lib.PcbLib; PCB Footprint: CAP0402_0-75
C439 = CAP_Dup3: CAP CERAMIC 18pF 50V 5% C0G(NP0) 0402; Mistral Part No: 120011090034-R; Mfr_name: KEMET; Mfr_part_number: C0402C180J5GAC7867; Part_type: CAPACITORS\CERAMIC; Wattage: NA; Project: TI_MAXIE_CPB; Customs_HS_Code: 85322990; Custom_Duty: 15%; Temperature: -55癈+125癈; Weight: 0.65mg; Tolerance: 5%; Package: 0402; Distributor_name: DIGIKEY; Distributor_part_number: 399-8952-1-ND; Height: 0.55MM; Datasheet: Y:\MIS_DATABASE\DATASHEETS\CAPACITORS\KEMET-C0G_SERIES.PDF; Crtd /date: ALVY/070220; Chkd/date: MANIRAJA/070220; Library Ref: CAP; Footprint Ref: CAP0402_0-75; MECHANICAL 3D STEP FILE: CAP0402_0-75; Library Path: Y:\MIS_DATABASE\Library\ALTIUM_TOOL\SCHEMATICS_PARTS\MS_DISCRETE_Library.schlib; Footprint Path: Y:\MIS_DATABASE\Library\ALTIUM_TOOL\PCB_FOOTPRINTS\Altium_Footprint_Lib.PcbLib; PCB Footprint: CAP0402_0-75
C441 = CAP_Dup3: CAP CERAMIC 3.3uF 6.3V 20% X5R AUTO 0603; Part_type: CAPACITORS\CERAMIC; Mfr_part_number: CGA3E3X5R0J335M080AB; Mfr_name: TDK; Mistral Part No: 120021020026-R; Custom_Duty: 15%; Customs_HS_Code: 85322990; Wattage: NA; Project: TI_AM243x LP EVM; Footprint Path: Y:\MIS_DATABASE\Library\ALTIUM_TOOL\PCB_FOOTPRINTS\Altium_Footprint_Lib.PcbLib; Library Path: Y:\MIS_DATABASE\Library\ALTIUM_TOOL\SCHEMATICS_PARTS\MS_DISCRETE_Library.schlib; MECHANICAL 3D STEP FILE: CAP0603_1; Chkd/date: ALVY/110221; Crtd /date: MANIRAJA/110221; Datasheet: Y:\MIS_DATABASE\DATASHEETS\CAPACITORS\CGA3E3X5R0J335M080AB.PDF; Temperature: -55癈+85癈; Weight: 6.3mg; Height: 0.90MM; Footprint Ref: CAP0603_1; Library Ref: CAP; Distributor_part_number: 445-12524-1-ND; Distributor_name: DIGIKEY; Package: 0603; Tolerance: 20%; PCB Footprint: CAP0603_1
D6 = DIODE_SOD323: DIODE 1CH ESD PROTECTION X1SON2; Mistral Part No: 130014110022-R; Mfr_name: TEXAS INSTRUMENTS; Project: GALILEO_EVM; Tolerance: NA; Customs_HS_Code: 85423100; Custom_Duty: 15%; PCB Footprint: DIO_DFN0402_0-5; Footprint Ref: DIO_DFN0402_0-5; Mfr_part_number: TPD1E10B06DPYR; Part_type: DIODE; Voltage: NA; Wattage: NA; Package: X1SON2; Distributor_name: DIGIKEY; Distributor_part_number: 296-30406-1-ND; Library Ref: DIODE_SOD323; Height: 0.45MM; Weight: 1mg; Temperature: -40癈+125癈; Datasheet: Y:\MIS_DATABASE\DATASHEETS\ICS\INTERFACE\TPD1E10B06-SER.PDF; Crtd /date: VASANTHA/181114; Chkd/date: MANIRAJA/040420; MECHANICAL 3D STEP FILE: DIO_DFN0402_0-5; Library Path: Y:\MIS_DATABASE\Library\ALTIUM_TOOL\SCHEMATICS_PARTS\MS_DISCRETE_Library.schlib; Footprint Path: Y:\MIS_DATABASE\Library\ALTIUM_TOOL\PCB_FOOTPRINTS\Altium_Footprint_Lib.PcbLib
FB23 FB24 = INDUCTOR_FERRITE: IND FERRITE BEAD CHIP 220E 300mA 0402; Mistral Part No: 130020080018-R; Mfr_name: WURTH ELECTRONICS; Mfr_part_number: 742792780; Project: AM64x_EVM_BRD; Tolerance: 25%; Voltage: NA; Customs_HS_Code: 85437099; Custom_Duty: 24%; PCB Footprint: IND0402_0-6; Footprint Ref: IND0402_0-6; Part_type: INDUCTOR; Wattage: NA; Package: 0402; Distributor_name: DIGIKEY; Distributor_part_number: 732-1569-1-ND; Library Ref: INDUCTOR_FERRITE; Height: 0.55MM; Weight: 0.65mg; Temperature: -55癈+125癈; Datasheet: Y:\MIS_DATABASE\DATASHEETS\DISCRETES\INDUCTORS\742792780.PDF; Crtd /date: ALVY/180820; Chkd/date: MANIRAJA/180820; MECHANICAL 3D STEP FILE: IND0402_0-6; Library Path: Y:\MIS_DATABASE\Library\ALTIUM_TOOL\SCHEMATICS_PARTS\MS_FILTER_Library.schlib; Footprint Path: Y:\MIS_DATABASE\Library\ALTIUM_TOOL\PCB_FOOTPRINTS\Altium_Footprint_Lib.PcbLib
J26 = CON_MUSB-B_5_1051640001: as J28 on sheet 22; PCB Footprint: CON_MUSBB5_1051640001_S_R_S_2-5; MECHANICAL 3D STEP FILE: CON_MUSBB5_1051640001_S_R_S_2-5; Chkd/date: MANIRAJA/230817; Crtd /date: MANIRAJA/230817; Datasheet: Y:\MIS_DATABASE\DATASHEETS\CONNECTORS\1051640001.PDF; Temperature: -35癈+85癈; Weight: 234mg; Height: 2.45MM; Distributor_part_number: WM11263CT-ND; Distributor_name: DIGIKEY; Package: SMD; Voltage: NA; Tolerance: NA; Mfr_part_number: 1051640001; Library Ref: CON_MUSB-B_5_1051640001
LD21 = DIODE_LED: DIODE LED BRIGHT GREEN SMD; Mistral Part No: 130020080012-R; Mfr_name: WURTH ELECTRONICS; Part_type: OPTO\LED; Project: AM64x_EVM_BRD; Tolerance: NA; Customs_HS_Code: 85439000; Custom_Duty: 24%; PCB Footprint: LED_150080VS75000_80X50_SMD_0-8; Footprint Ref: LED_150080VS75000_80X50_SMD_0-8; Mfr_part_number: 150080VS75000; Voltage: NA; Wattage: NA; Package: SMD; Distributor_name: DIGIKEY; Distributor_part_number: 732-4986-1-ND; Library Ref: DIODE_LED; Height: 0.80MM; Weight: 10mg; Temperature: -40癈+85癈; Datasheet: Y:\MIS_DATABASE\DATASHEETS\DISCRETES\LEDS\150080VS75000.PDF; Crtd /date: ALVY/180820; Chkd/date: MANIRAJA/180820; MECHANICAL 3D STEP FILE: LED_150080VS75000_80X50_SMD_0-8; Library Path: Y:\MIS_DATABASE\Library\ALTIUM_TOOL\SCHEMATICS_PARTS\MS_OPTO_Library.schlib; Footprint Path: Y:\MIS_DATABASE\Library\ALTIUM_TOOL\PCB_FOOTPRINTS\Altium_Footprint_Lib.PcbLib
R175 = RESISTOR_Dup6: RES 12K 1/10W 1% 0402; Mistral Part No: 110019040053-R; Mfr_name: PANASONIC-ECG; Mfr_part_number: ERJ-2RKF1202X; Part_type: RESISTORS\FIXED; Project: TI_C5545; Voltage: NA; Customs_HS_Code: 85332119; Custom_Duty: 15%; Library Ref: RESISTOR; Tolerance: 1%; Wattage: 1/10W; Package: 0402; Distributor_name: DIGIKEY; Distributor_part_number: P12.0KLCT-ND; Height: 0.40MM; Weight: 0.8mg; Temperature: -55癈+155癈; Datasheet: Y:\MIS_DATABASE\DATASHEETS\RESISTORS\PAN-ERJSER_NOV17.PDF; Crtd /date: VASANTHA/041215; Chkd/date: VASANTHA/041215; Footprint Ref: RES0402_0-5; PCB Footprint: RES0402_0-5; MECHANICAL 3D STEP FILE: RES0402_0-5; Library Path: Y:\MIS_DATABASE\Library\ALTIUM_TOOL\SCHEMATICS_PARTS\MS_DISCRETE_Library.schlib; Footprint Path: Y:\MIS_DATABASE\Library\ALTIUM_TOOL\PCB_FOOTPRINTS\Altium_Footprint_Lib.PcbLib
R182 = RESISTOR_Dup6: RES 0E 1/4W JUMPER 1206; Mistral Part No: 110010030045-R; Mfr_name: STACKPOLE ELECTRONICS; Mfr_part_number: RMCF1206ZT0R00; Part_type: RESISTORS\FIXED; Project: QCH HSAD_BRD; Tolerance: NA; Customs_HS_Code: 85332119; Custom_Duty: 15%; PCB Footprint: RES1206_0-75; Footprint Ref: RES1206_0-75; Voltage: NA; Wattage: 1/4W; Package: 1206; Distributor_name: DIGIKEY; Distributor_part_number: RMCF1206ZT0R00CT-ND; Library Ref: RESISTOR; Height: 0.70MM; Weight: 8.86mg; Temperature: -55癈+155癈; Datasheet: Y:\MIS_DATABASE\DATASHEETS\RESISTORS\RMCF-SER_JUL18.PDF; Crtd /date: ALVY/150519; Chkd/date: MANIRAJA/150519; MECHANICAL 3D STEP FILE: RES1206_0-75; Library Path: Y:\MIS_DATABASE\Library\ALTIUM_TOOL\SCHEMATICS_PARTS\MS_DISCRETE_Library.schlib; Footprint Path: Y:\MIS_DATABASE\Library\ALTIUM_TOOL\PCB_FOOTPRINTS\Altium_Footprint_Lib.PcbLib
R186 R191 R397 R403 R406 R438 R445 = RESISTOR_Dup6: as R199 on sheet 22; Footprint Path: Y:\MIS_DATABASE\Library\ALTIUM_TOOL\PCB_FOOTPRINTS\Altium_Footprint_Lib.PcbLib; Library Path: Y:\MIS_DATABASE\Library\ALTIUM_TOOL\SCHEMATICS_PARTS\MS_DISCRETE_Library.schlib; Footprint Ref: RES0402_0-5; Library Ref: RESISTOR; MECHANICAL 3D STEP FILE: RES0402_0-5; Chkd/date: VASANTHA/061216; Crtd /date: MAZHAR/230805; Datasheet: Y:\MIS_DATABASE\DATASHEETS\RESISTORS\RCXXXXL-SER_MAR18.PDF; Temperature: -55癈+155癈; Weight: 0.65mg; Height: 0.40MM; Distributor_part_number: 311-10KJRCT-ND; Distributor_name: DIGIKEY; Package: 0402; Wattage: 1/16W; Tolerance: 5%; PCB Footprint: RES0402_0-5
R192 = RESISTOR_Dup6: RES 2.2K 1/16W 5% 0402; Mistral Part No: 110010120018-R; Mfr_name: YAGEO AMERICA; Mfr_part_number: RC0402JR-072K2L; Part_type: RESISTORS\FIXED; Project: TE4; Voltage: NA; Customs_HS_Code: 85332119; Custom_Duty: 15%; Library Ref: RESISTOR; Tolerance: 5%; Wattage: 1/16W; Package: 0402; Distributor_name: DIGIKEY; Distributor_part_number: 311-2.2KJRCT-ND; Height: 0.40MM; Weight: 0.65mg; Temperature: -55癈+155癈; Datasheet: Y:\MIS_DATABASE\DATASHEETS\RESISTORS\RCXXXXL-SER_MAR18.PDF; Crtd /date: BAVISH/021210; Chkd/date: VASANTHA/061216; MECHANICAL 3D STEP FILE: RES0402_0-5; Footprint Path: Y:\MIS_DATABASE\Library\ALTIUM_TOOL\PCB_FOOTPRINTS\Altium_Footprint_Lib.PcbLib; PCB Footprint: RES0402_0-5; Footprint Ref: RES0402_0-5; Library Path: Y:\MIS_DATABASE\Library\ALTIUM_TOOL\SCHEMATICS_PARTS\MS_DISCRETE_Library.schlib
R400 R463 = RESISTOR_Dup6: as R198 on sheet 22; Footprint Path: Y:\MIS_DATABASE\Library\ALTIUM_TOOL\PCB_FOOTPRINTS\Altium_Footprint_Lib.PcbLib; Library Path: Y:\MIS_DATABASE\Library\ALTIUM_TOOL\SCHEMATICS_PARTS\MS_DISCRETE_Library.schlib; Footprint Ref: RES0402_0-5; Library Ref: RESISTOR; Tolerance: 5%; Wattage: 1/16W; Package: 0402; Distributor_name: DIGIKEY; Distributor_part_number: 311-10KJRCT-ND; Height: 0.40MM; Weight: 0.65mg; Temperature: -55癈+155癈; Datasheet: Y:\MIS_DATABASE\DATASHEETS\RESISTORS\RCXXXXL-SER_MAR18.PDF; Crtd /date: MAZHAR/230805; Chkd/date: VASANTHA/061216; MECHANICAL 3D STEP FILE: RES0402_0-5; PCB Footprint: RES0402_0-5
R417 = RESISTOR_Dup3: RES 10K 1/16W 1% 0402; Mistral Part No: 110015090015-R; Mfr_name: YAGEO AMERICA; Mfr_part_number: RC0402FR-0710KL; Part_type: RESISTORS\FIXED; PCB Footprint: RES0402_0-5; Voltage: NA; Project: VOCERA; Customs_HS_Code: 85332119; Custom_Duty: 15%; MECHANICAL 3D STEP FILE: RES0402_0-5; Temperature: -55癈+155癈; Weight: 0.65mg; Tolerance: 1%; Wattage: 1/16W; Package: 0402; Distributor_name: DIGIKEY; Distributor_part_number: 311-10.0KLRTR-ND; Height: 0.40MM; Datasheet: Y:\MIS_DATABASE\DATASHEETS\RESISTORS\RCXXXXL-SER_MAR18.PDF; Crtd /date: GEETHA/290506; Chkd/date: VASANTHA/201216; Library Ref: RESISTOR; Footprint Ref: RES0402_0-5; Library Path: Y:\MIS_DATABASE\Library\ALTIUM_TOOL\SCHEMATICS_PARTS\MS_DISCRETE_Library.schlib; Footprint Path: Y:\MIS_DATABASE\Library\ALTIUM_TOOL\PCB_FOOTPRINTS\Altium_Footprint_Lib.PcbLib
R464 = RESISTOR_Dup6: as R462 on sheet 22; PCB Footprint: RES0402_0-5; Library Ref: RESISTOR; Tolerance: 5%; Wattage: 1/10W; Package: 0402; Distributor_name: DIGIKEY; Distributor_part_number: P220JCT-ND; Height: 0.40MM; Datasheet: Y:\MIS_DATABASE\DATASHEETS\RESISTORS\PAN-ERJSER_NOV17.PDF; Crtd /date: GEETHA/260406; Chkd/date: VASANTHA/291216; Weight: 0.8mg; Temperature: -55癈+155癈; MECHANICAL 3D STEP FILE: RES0402_0-5; Library Path: Y:\MIS_DATABASE\Library\ALTIUM_TOOL\SCHEMATICS_PARTS\MS_DISCRETE_Library.schlib; Footprint Path: Y:\MIS_DATABASE\Library\ALTIUM_TOOL\PCB_FOOTPRINTS\Altium_Footprint_Lib.PcbLib; Footprint Ref: RES0402_0-5
R608 R610 R611 = RESISTOR_Dup6: RES 4.7K 1/16W 5% 0402; Mistral Part No: 110011060001-R; Mfr_name: YAGEO AMERICA; Mfr_part_number: RC0402JR-074K7L; Part_type: RESISTORS\FIXED; Project: TMDXCSK368; Voltage: NA; Customs_HS_Code: 85332119; Custom_Duty: 15%; Tolerance: 5%; Wattage: 1/16W; Package: 0402; Distributor_name: DIGIKEY; Distributor_part_number: 311-4.7KJRCT-ND; Library Ref: RESISTOR; Footprint Ref: RES0402_0-5; Height: 0.40MM; Weight: 0.65mg; Temperature: -55癈+155癈; Datasheet: Y:\MIS_DATABASE\DATASHEETS\RESISTORS\RCXXXXL-SER_MAR18.PDF; Crtd /date: VASANTHA/130516; Chkd/date: VASANTHA/130516; MECHANICAL 3D STEP FILE: RES0402_0-5; Library Path: Y:\MIS_DATABASE\Library\ALTIUM_TOOL\SCHEMATICS_PARTS\MS_DISCRETE_Library.schlib; Footprint Path: Y:\MIS_DATABASE\Library\ALTIUM_TOOL\PCB_FOOTPRINTS\Altium_Footprint_Lib.PcbLib; PCB Footprint: RES0402_0-5
R609 = RESISTOR_Dup6: RES 4.7K 1/16W 5% 0402; Part_type: RESISTORS\FIXED; Mfr_part_number: RC0402JR-074K7L; Mfr_name: YAGEO AMERICA; Mistral Part No: 110011060001-R; Custom_Duty: 15%; Customs_HS_Code: 85332119; Voltage: NA; Project: TMDXCSK368; Footprint Path: Y:\MIS_DATABASE\Library\ALTIUM_TOOL\PCB_FOOTPRINTS\Altium_Footprint_Lib.PcbLib; Library Path: Y:\MIS_DATABASE\Library\ALTIUM_TOOL\SCHEMATICS_PARTS\MS_DISCRETE_Library.schlib; MECHANICAL 3D STEP FILE: RES0402_0-5; Chkd/date: VASANTHA/130516; Crtd /date: VASANTHA/130516; Datasheet: Y:\MIS_DATABASE\DATASHEETS\RESISTORS\RCXXXXL-SER_MAR18.PDF; Temperature: -55癈+155癈; Weight: 0.65mg; Height: 0.40MM; Footprint Ref: RES0402_0-5; Library Ref: RESISTOR; Distributor_part_number: 311-4.7KJRCT-ND; Distributor_name: DIGIKEY; Package: 0402; Wattage: 1/16W; Tolerance: 5%; PCB Footprint: RES0402_0-5
U42 = TPD4E004_SON6: IC 4-CH ESD PROTECTION ARRAY FOR HIGH SPEED DATA INTERFACE SON6; Mistral Part No: 141010020012-R; Mfr_name: TEXAS INSTRUMENTS; Part_type: ICS\INTERFACE; Project: BUG_BASE-II; Customs_HS_Code: 85423100; Custom_Duty: 15%; Tolerance: NA; PCB Footprint: SON6_19-68_40X60_PB_0-6; Mfr_part_number: TPD4E004DRYR; Package: SON6; Distributor_name: DIGIKEY; Distributor_part_number: 296-23618-1-ND; Height: 0.60MM; Weight: 3.2mg; Temperature: -40癈+85癈; Datasheet: Y:\MIS_DATABASE\DATASHEETS\ICS\INTERFACE\TPD4E004-SER.PDF; Crtd /date: MUDDU/010310; Chkd/date: MANIRAJA/100320; Library Ref: TPD4E004_SON6; Footprint Ref: SON6_19-68_40X60_PB_0-6; Voltage: NA; Wattage: NA; MECHANICAL 3D STEP FILE: SON6_19-68_40X60_PB_0-6; Library Path: Y:\MIS_DATABASE\Library\ALTIUM_TOOL\SCHEMATICS_PARTS\MS_MISCINTERFACE_Library.schlib; Footprint Path: Y:\MIS_DATABASE\Library\ALTIUM_TOOL\PCB_FOOTPRINTS\Altium_Footprint_Lib.PcbLib
U43 = TPS73501DRVR_SON6: IC 500mA LOW DROPOUT REGULATOR SON6; Part_type: ICS\POWER\VOLTAGE REGULATOR; Mfr_name: TEXAS INSTRUMENTS; Mistral Part No: 142014100001-R; Custom_Duty: 15%; Customs_HS_Code: 85423100; Wattage: NA; Project: BLUETOOTH_WATCH; PCB Footprint: SON6_25-59_85X85; Library Ref: TPS73501DRVR_SON6; Chkd/date: VASANTHA/280915; Crtd /date: NAVEED/011014; Datasheet: Y:\MIS_DATABASE\DATASHEETS\ICS\POWER\TPS735.PDF; Temperature: -40癈+125癈; Weight: NA; Height: 0.80MM; Distributor_part_number: TPS73533DRVR-ND; Distributor_name: DIGIKEY; Package: SON6; Voltage: NA; Tolerance: NA; Mfr_part_number: TPS73533DRVR
U82 U89 = SN74AVC4T245RSV_UQFN16: IC 2-BIT BUS TRANSCEIVER WITH CONFIGURABLE VOLTAGE TRANSLATION AND 3 STATE O/P UQFN16; Part_type: ICS\DIGITAL\BUSTRANSCEIVER; Mfr_name: TEXAS INSTRUMENTS; Mistral Part No: 141011040011-R; Custom_Duty: 15%; Customs_HS_Code: 85423100; Wattage: NA; Project: HMC; PCB Footprint: UQFN16_TMUX1574_70X100_0-6; MECHANICAL 3D STEP FILE: UQFN16_TMUX1574_70X100_0-6; Chkd/date: MANIRAJA/040520; Crtd /date: BAVISH/190411; Datasheet: Y:\MIS_DATABASE\DATASHEETS\ICS\DIGITAL\BUSTRANSCEIVER\SN74AVC4T245-SER.PDF; Temperature: -40癈+85癈; Weight: 41mg; Height: 0.55MM; Distributor_part_number: 296-24366-1-ND; Distributor_name: DIGIKEY; Package: UQFN16; Voltage: NA; Tolerance: NA; Mfr_part_number: SN74AVC4T245RSVR; Library Ref: SN74AVC4T245RSV_UQFN16; Footprint Ref: UQFN16_TMUX1574_70X100_0-6; Library Path: Y:\MIS_DATABASE\Library\ALTIUM_TOOL\SCHEMATICS_PARTS\MS_BUSDRIVERTRANSCEIVER_Library.schlib; Footprint Path: Y:\MIS_DATABASE\Library\ALTIUM_TOOL\PCB_FOOTPRINTS\Altium_Footprint_Lib.PcbLib
U84 = SN74AVC4T245RSV_UQFN16: IC 2-BIT BUS TRANSCEIVER WITH CONFIGURABLE VOLTAGE TRANSLATION AND 3 STATE O/P UQFN16; Mistral Part No: 141011040011-R; Mfr_name: TEXAS INSTRUMENTS; Part_type: ICS\DIGITAL\BUSTRANSCEIVER; Project: HMC; Tolerance: NA; Customs_HS_Code: 85423100; Custom_Duty: 15%; Library Ref: SN74AVC4T245RSV_UQFN16; Mfr_part_number: SN74AVC4T245RSVR; Voltage: NA; Wattage: NA; Package: UQFN16; Distributor_name: DIGIKEY; Distributor_part_number: 296-24366-1-ND; Height: 0.55MM; Weight: 41mg; Temperature: -40癈+85癈; Datasheet: Y:\MIS_DATABASE\DATASHEETS\ICS\DIGITAL\BUSTRANSCEIVER\SN74AVC4T245-SER.PDF; Crtd /date: BAVISH/190411; Chkd/date: MANIRAJA/040520; MECHANICAL 3D STEP FILE: UQFN16_TMUX1574_70X100_0-6; Footprint Ref: UQFN16_TMUX1574_70X100_0-6; Library Path: Y:\MIS_DATABASE\Library\ALTIUM_TOOL\SCHEMATICS_PARTS\MS_BUSDRIVERTRANSCEIVER_Library.schlib; Footprint Path: Y:\MIS_DATABASE\Library\ALTIUM_TOOL\PCB_FOOTPRINTS\Altium_Footprint_Lib.PcbLib; PCB Footprint: UQFN16_TMUX1574_70X100_0-6
U87 = FT4232H _LQFP64: IC HIGH SPEED QUAD USB UART LQFP64; Mistral Part No: 141013080006-R; Mfr_name: FTDI; Mfr_part_number: FT4232HL-REEL; Part_type: ICS\DIGITAL\PERIPHERAL; PCB Footprint: LQFP64_19-68_390X390_1-6; Project: DM37XX; Tolerance: NA; Customs_HS_Code: 85423100; Custom_Duty: 15%; Footprint Path: Y:\MIS_DATABASE\Library\ALTIUM_TOOL\PCB_FOOTPRINTS\Altium_Footprint_Lib.PcbLib; Library Path: Y:\MIS_DATABASE\Library\ALTIUM_TOOL\SCHEMATICS_PARTS\MS_COMBINATIONAL_Library.schlib; Footprint Ref: LQFP64_19-68_390X390_1-6; MECHANICAL 3D STEP FILE: LQFP64_19-68_390X390_1-6; Voltage: NA; Wattage: NA; Package: LQFP64; Distributor_name: DIGIKEY; Distributor_part_number: 768-1026-1-ND; Height: 1.60MM; Weight: 342.7mg; Temperature: -40癈+85癈; Datasheet: Y:\MIS_DATABASE\DATASHEETS\ICS\DIGITAL\PERIPHERAL\FT4232HX.PDF; Crtd /date: VIJAYALAKSHMI/120813; Chkd/date: MANIRAJA/110917; Library Ref: FT4232H_LQFP64
U92 = 93LC46B_MSOP8: IC 1K MICROWIRE COMPATIBLE SERIAL EEPROM MSOP8; Mistral Part No: 141118020002-R; Mfr_name: MICROCHIP; Mfr_part_number: 93LC46B-I/MS; Part_type: ICS\DIGITAL\MEMORY; Project: TI_MAXIE_CPB; Tolerance: NA; Customs_HS_Code: 85423100; Custom_Duty: 15%; Footprint Ref: MSOP8_25-59_125X125_1-1; Library Ref: 93LC46B_MSOP8; Voltage: NA; Wattage: NA; Package: MSOP8; Distributor_name: DIGIKEY; Distributor_part_number: 93LC46B-I/MS-ND; Height: 1.10MM; Weight: 140mg; Temperature: -40癈+85癈; Datasheet: Y:\MIS_DATABASE\DATASHEETS\ICS\MEMORY\93LC46B.PDF; Crtd /date: ALVY/150218; Chkd/date: MANIRAJA/150218; MECHANICAL 3D STEP FILE: MSOP8_25-59_125X125_1-1; Library Path: Y:\MIS_DATABASE\Library\ALTIUM_TOOL\SCHEMATICS_PARTS\MS_MISCMEMORY_Library.schlib; Footprint Path: Y:\MIS_DATABASE\Library\ALTIUM_TOOL\PCB_FOOTPRINTS\Altium_Footprint_Lib.PcbLib; PCB Footprint: MSOP8_25-59_125X125_1-1
Y3 = CRY: CRY 12.000MHz 18pF SMD; Mistral Part No: 130018080040-R; Mfr_name: CTS; Mfr_part_number: 445I23D12M00000; Part_type: CRYSTAL; Project: TI_MAXIE_CPB; Tolerance: NA; Customs_HS_Code: 85439000; Custom_Duty: 24%; Footprint Path: Y:\MIS_DATABASE\Library\ALTIUM_TOOL\PCB_FOOTPRINTS\Altium_Footprint_Lib.PcbLib; Library Path: Y:\MIS_DATABASE\Library\ALTIUM_TOOL\SCHEMATICS_PARTS\MS_DISCRETE_Library.schlib; MECHANICAL 3D STEP FILE: XTAL_ABM3_205X130_SMD_1-4; Footprint Ref: XTAL_ABM3_205X130_SMD_1-4; Library Ref: CRY; Voltage: NA; Wattage: NA; Package: SMD; Distributor_name: DIGIKEY; Distributor_part_number: CTX1170CT-ND; Height: 1.35MM; Weight: 50mg; Temperature: -40癈+85癈; Datasheet: Y:\MIS_DATABASE\DATASHEETS\MISC\CRY_OSC\445.PDF; Crtd /date: MANIRAJA/310818; Chkd/date: MANIRAJA/310818; PCB Footprint: XTAL_ABM3_205X130_SMD_1-4